# Altium project Prom21_Oculink_GPU_Ver0.1.PrjPcb
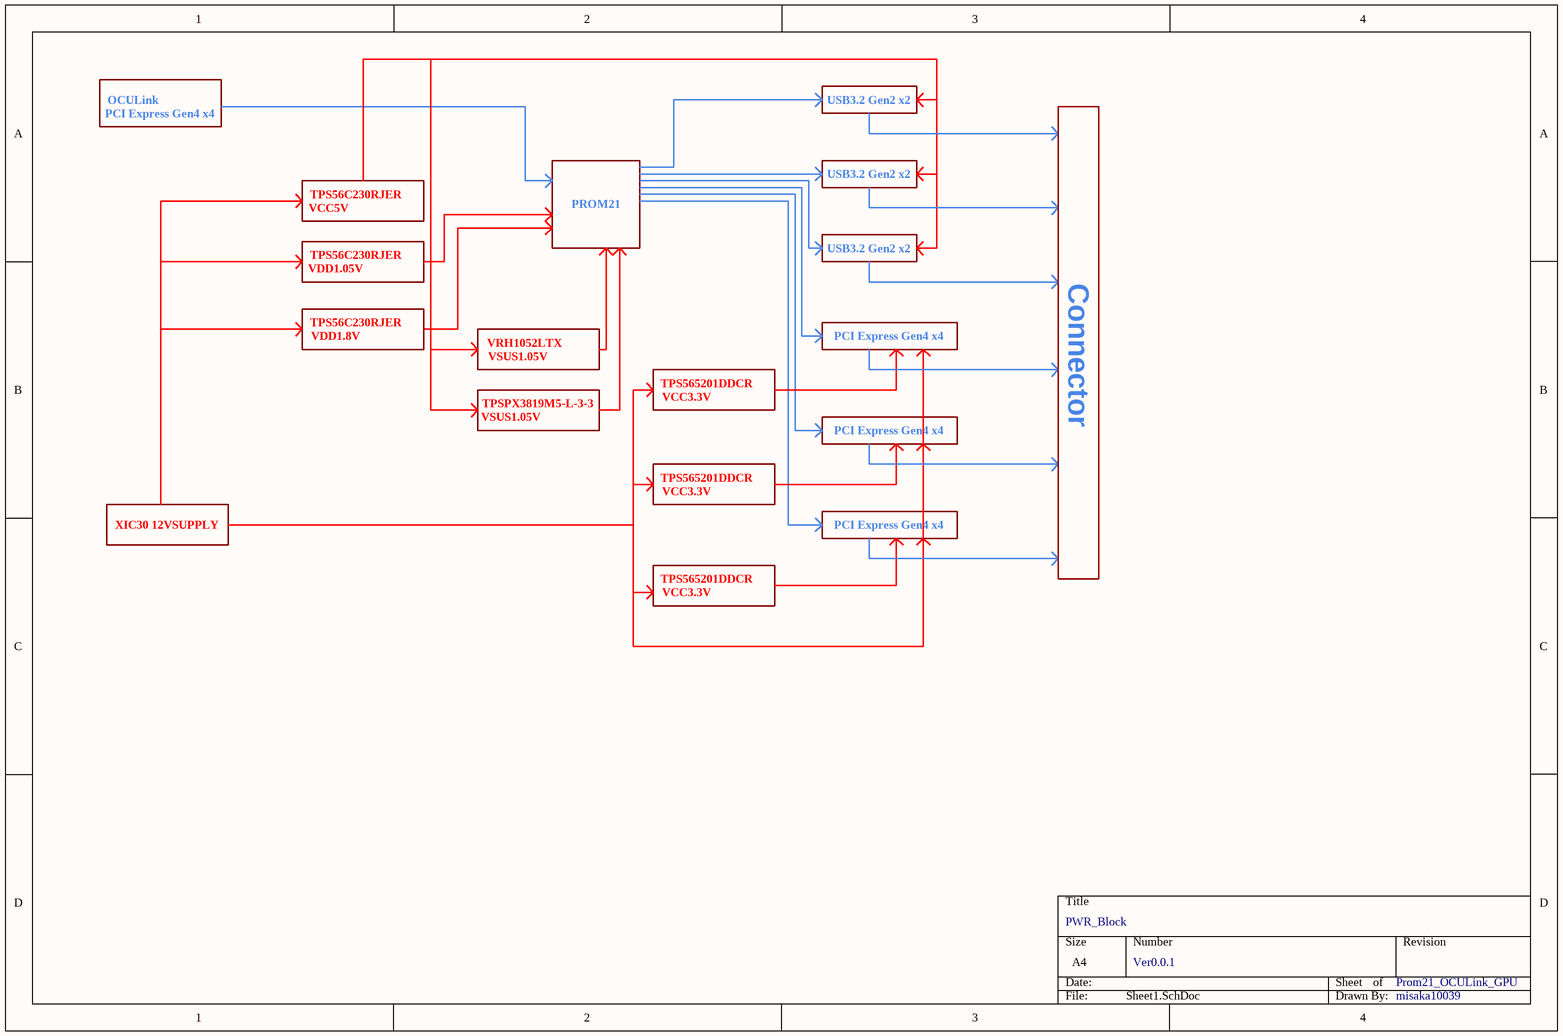
[diagram p0: Sheet1.SchDoc]
6 sheets, 307 parts. Net scope: global (net labels, ports and power ports of the same name join across sheets).
Board file: Prom21_Oculink_GPU_Ver0.1.PcbDoc
Sheets:
  Sheet1.SchDoc
  Connector.SchDoc
  Prom21Core.SchDoc
  pwr.SchDoc
  USB.SchDoc
  Signal.SchDoc

## Sheet Sheet1.SchDoc: PWR_Block
size A4; DrawnBy: misaka10039; SheetNumber: 1; SheetTotal: 4

### Notes on the sheet
- OCULink
- PCI Express Gen4 x4
- USB3.2 Gen2 x2
- VCC5V
- TPS56C230RJER
- PROM21
- VDD1.05V
- VDD1.8V
- VSUS1.05V
- VRH1052LTX
- TPS565201DDCR
- Connector
- TPSPX3819M5-L-3-3
- VCC3.3V
- XIC30 12VSUPPLY
- PWR_Block
- Ver0.0.1
- Prom21_OCULink_GPU
- misaka10039

## Sheet Connector.SchDoc
size A2; SheetNumber: 2; SheetTotal: 6
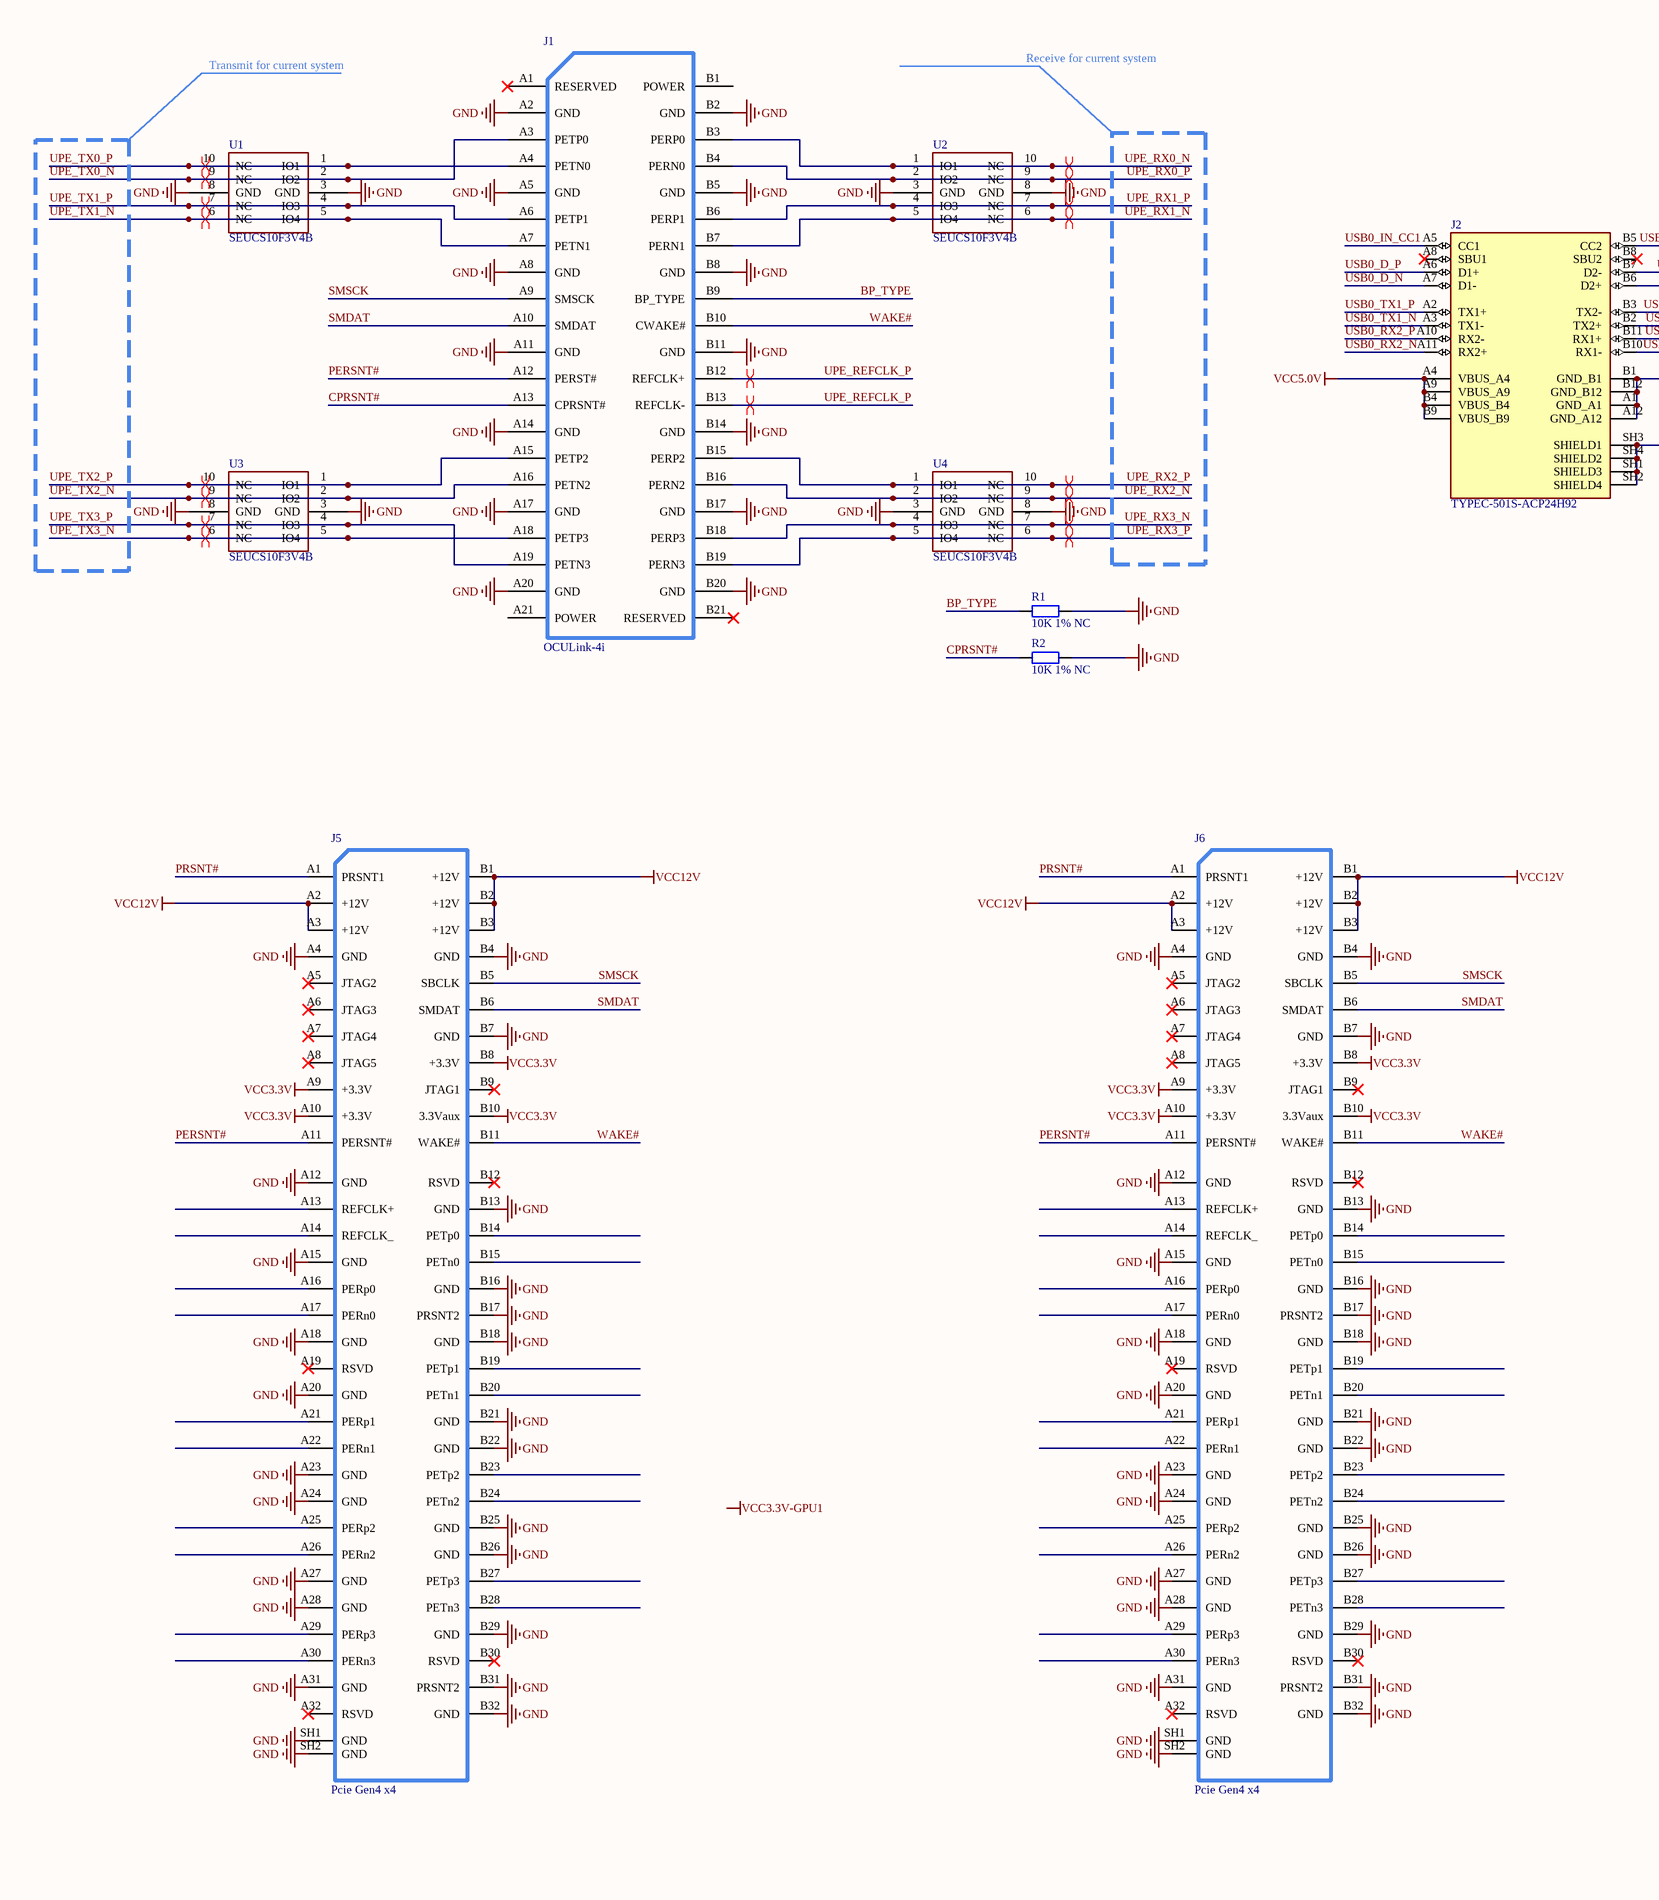
[diagram p1: Connector.SchDoc, left]
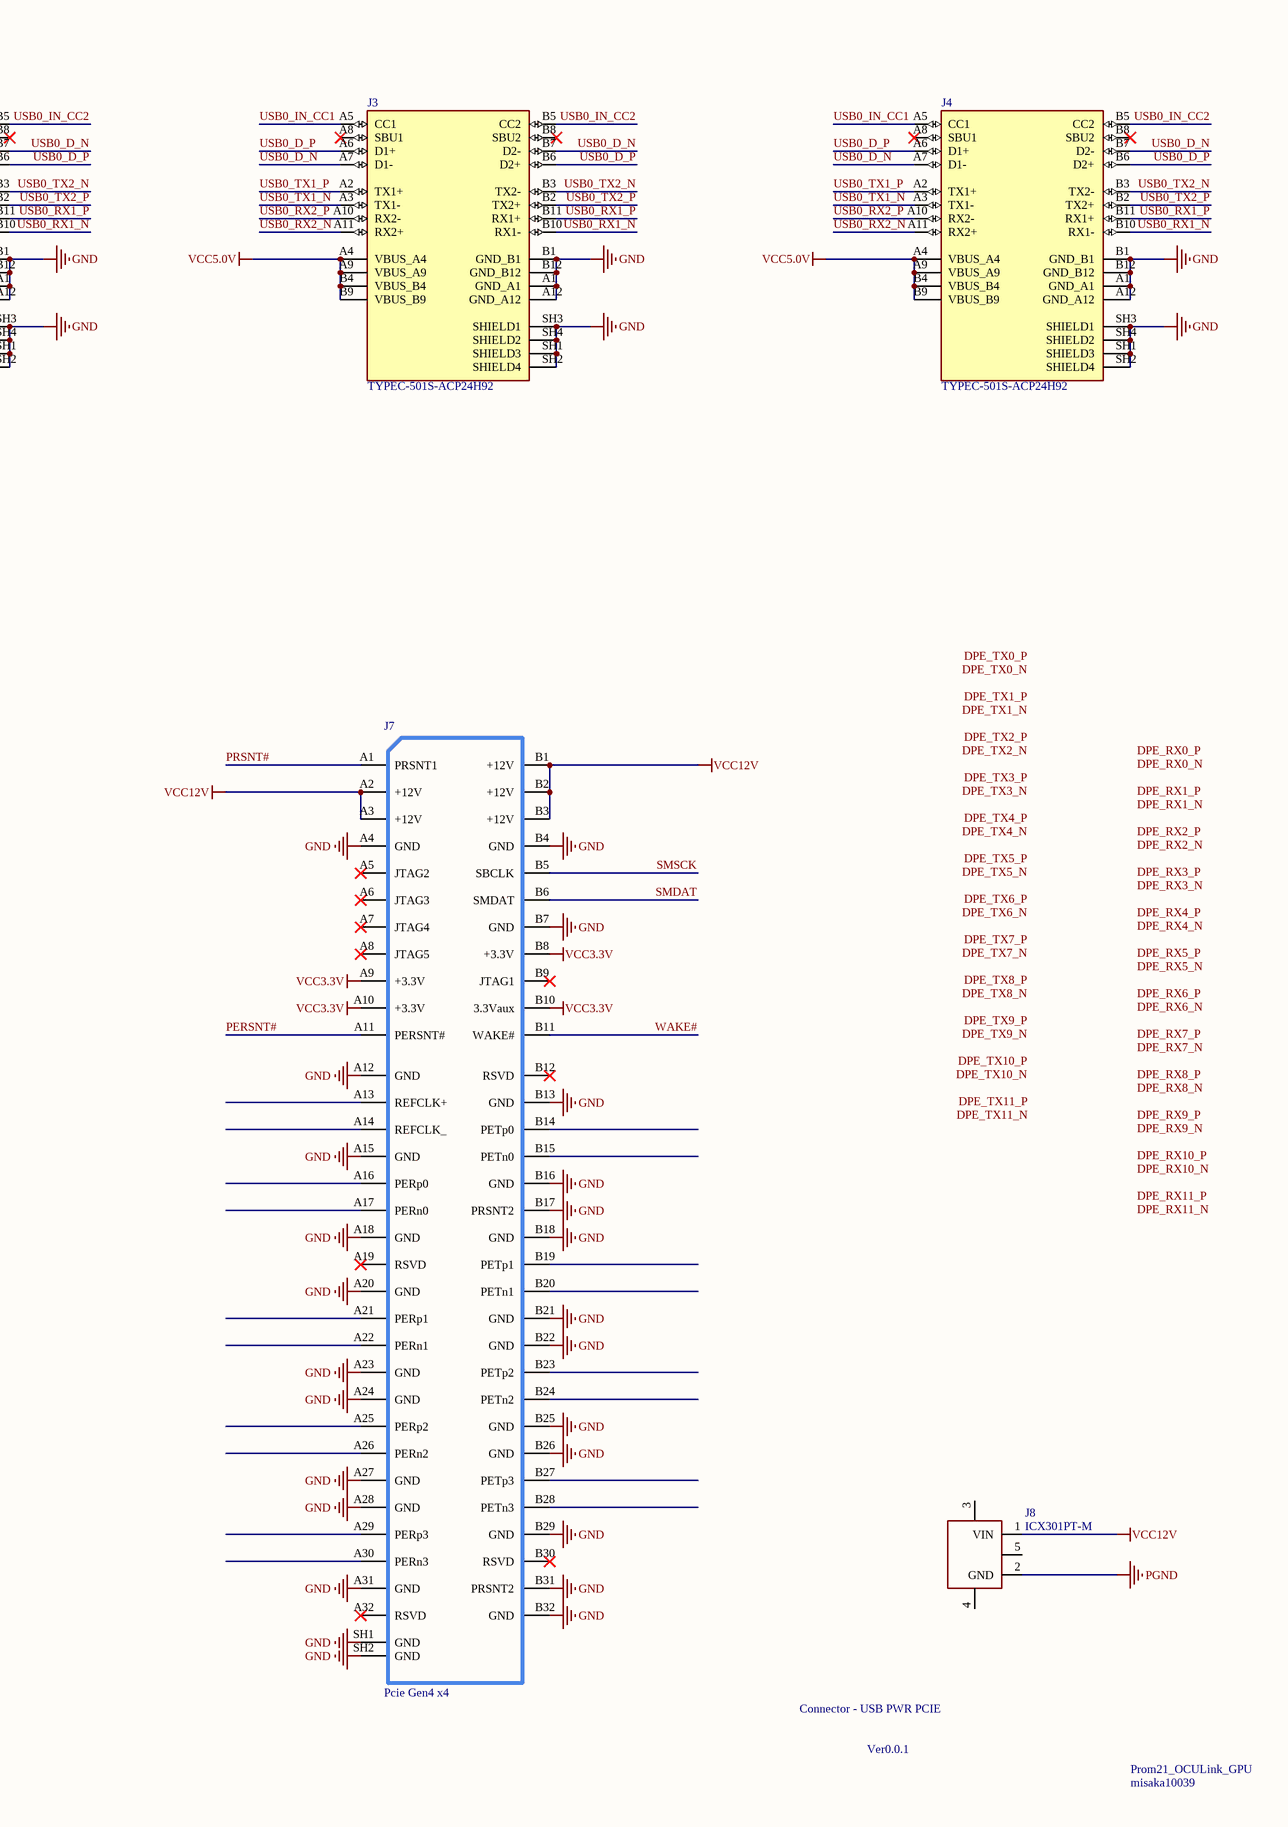
[diagram p2: Connector.SchDoc, right]

### Parts
J1  OCULink-4i  [SFF8611_卧式]
J2  TYPEC-501S-ACP24H92  [USB-C 24P Molex]
J3  TYPEC-501S-ACP24H92  [USB-C 24P Molex]
J4  TYPEC-501S-ACP24H92  [USB-C 24P Molex]
J5  Pcie Gen4 x4  [PCIe Gen4 X4 贴片]
J6  Pcie Gen4 x4  [PCIe Gen4 X4 贴片]
J7  Pcie Gen4 x4  [PCIe Gen4 X4 贴片]
J8  ICX301PT-M  [CONN-SMD_ICX301PT-M]
R1  10K 1% NC  [R0402_L]
R2  10K 1% NC  [R0402_L]
U1  SEUCS10F3V4B  [DIO_TPD4E02B04DQAR]
U2  SEUCS10F3V4B  [DIO_TPD4E02B04DQAR]
U3  SEUCS10F3V4B  [DIO_TPD4E02B04DQAR]
U4  SEUCS10F3V4B  [DIO_TPD4E02B04DQAR]

### Nets
GND: J1.A2(GND) J1.A5(GND) J1.A8(GND) J1.A11(GND) J1.A14(GND) J1.A17(GND) J1.A20(GND) J1.B2(GND) J1.B5(GND) J1.B8(GND) J1.B11(GND) J1.B14(GND) J1.B17(GND) J1.B20(GND) J2.A1(GND_A1) J2.A12(GND_A12) J2.B1(GND_B1) J2.B12(GND_B12) J2.SH1(SHIELD3) J2.SH2(SHIELD4) J2.SH3(SHIELD1) J2.SH4(SHIELD2) J3.A1(GND_A1) J3.A12(GND_A12) J3.B1(GND_B1) J3.B12(GND_B12) J3.SH1(SHIELD3) J3.SH2(SHIELD4) J3.SH3(SHIELD1) J3.SH4(SHIELD2) J4.A1(GND_A1) J4.A12(GND_A12) J4.B1(GND_B1) J4.B12(GND_B12) J4.SH1(SHIELD3) J4.SH2(SHIELD4) J4.SH3(SHIELD1) J4.SH4(SHIELD2) J5.A4(GND) J5.A12(GND) J5.A15(GND) J5.A18(GND) J5.A20(GND) J5.A23(GND) J5.A24(GND) J5.A27(GND) J5.A28(GND) J5.A31(GND) J5.B4(GND) J5.B7(GND) J5.B13(GND) J5.B16(GND) J5.B17(PRSNT2) J5.B18(GND) J5.B21(GND) J5.B22(GND) J5.B25(GND) J5.B26(GND) J5.B29(GND) J5.B31(PRSNT2) J5.B32(GND) J5.SH1(GND) J5.SH2(GND) J6.A4(GND) J6.A12(GND) J6.A15(GND) J6.A18(GND) J6.A20(GND) J6.A23(GND) J6.A24(GND) J6.A27(GND) J6.A28(GND) J6.A31(GND) J6.B4(GND) J6.B7(GND) J6.B13(GND) J6.B16(GND) J6.B17(PRSNT2) J6.B18(GND) J6.B21(GND) J6.B22(GND) J6.B25(GND) J6.B26(GND) J6.B29(GND) J6.B31(PRSNT2) J6.B32(GND) J6.SH1(GND) J6.SH2(GND) J7.A4(GND) J7.A12(GND) J7.A15(GND) J7.A18(GND) J7.A20(GND) J7.A23(GND) J7.A24(GND) J7.A27(GND) J7.A28(GND) J7.A31(GND) J7.B4(GND) J7.B7(GND) J7.B13(GND) J7.B16(GND) J7.B17(PRSNT2) J7.B18(GND) J7.B21(GND) J7.B22(GND) J7.B25(GND) J7.B26(GND) J7.B29(GND) J7.B31(PRSNT2) J7.B32(GND) J7.SH1(GND) J7.SH2(GND) R1.1 R2.1 U1.3(GND) U1.8(GND) U2.3(GND) U2.8(GND) U3.3(GND) U3.8(GND) U4.3(GND) U4.8(GND)
PGND: J8.2(GND)
VCC3.3V: J5.A9(+3.3V) J5.A10(+3.3V) J5.B8(+3.3V) J5.B10(3.3Vaux) J6.A9(+3.3V) J6.A10(+3.3V) J6.B8(+3.3V) J6.B10(3.3Vaux) J7.A9(+3.3V) J7.A10(+3.3V) J7.B8(+3.3V) J7.B10(3.3Vaux)
VCC5.0V: J2.A4(VBUS_A4) J2.A9(VBUS_A9) J2.B4(VBUS_B4) J2.B9(VBUS_B9) J3.A4(VBUS_A4) J3.A9(VBUS_A9) J3.B4(VBUS_B4) J3.B9(VBUS_B9) J4.A4(VBUS_A4) J4.A9(VBUS_A9) J4.B4(VBUS_B4) J4.B9(VBUS_B9)
VCC12V: J5.A2(+12V) J5.A3(+12V) J5.B1(+12V) J5.B2(+12V) J5.B3(+12V) J6.A2(+12V) J6.A3(+12V) J6.B1(+12V) J6.B2(+12V) J6.B3(+12V) J7.A2(+12V) J7.A3(+12V) J7.B1(+12V) J7.B2(+12V) J7.B3(+12V) J8.1(VIN)
BP_TYPE: J1.B9(BP_TYPE) R1.2
CPRSNT#: J1.A13(CPRSNT#) R2.2
PERSNT#: J1.A12(PERST#) J5.A11(PERSNT#) J6.A11(PERSNT#) J7.A11(PERSNT#)
PRSNT#: J5.A1(PRSNT1) J6.A1(PRSNT1) J7.A1(PRSNT1)
SMDAT: J1.A10(SMDAT) J5.B6(SMDAT) J6.B6(SMDAT) J7.B6(SMDAT)
SMSCK: J1.A9(SMSCK) J5.B5(SBCLK) J6.B5(SBCLK) J7.B5(SBCLK)
UPE_REFCLK_P: J1.B12(REFCLK+) J1.B13(REFCLK-)
UPE_RX0_N: J1.B3(PERP0) U2.1(IO1) U2.10(NC)
UPE_RX0_P: J1.B4(PERN0) U2.2(IO2) U2.9(NC)
UPE_RX1_N: J1.B7(PERN1) U2.5(IO4) U2.6(NC)
UPE_RX1_P: J1.B6(PERP1) U2.4(IO3) U2.7(NC)
UPE_RX2_N: J1.B16(PERN2) U4.2(IO2) U4.9(NC)
UPE_RX2_P: J1.B15(PERP2) U4.1(IO1) U4.10(NC)
UPE_RX3_N: J1.B18(PERP3) U4.4(IO3) U4.7(NC)
UPE_RX3_P: J1.B19(PERN3) U4.5(IO4) U4.6(NC)
UPE_TX0_N: J1.A3(PETP0) U1.2(IO2) U1.9(NC)
UPE_TX0_P: J1.A4(PETN0) U1.1(IO1) U1.10(NC)
UPE_TX1_N: J1.A7(PETN1) U1.5(IO4) U1.6(NC)
UPE_TX1_P: J1.A6(PETP1) U1.4(IO3) U1.7(NC)
UPE_TX2_N: J1.A16(PETN2) U3.2(IO2) U3.9(NC)
UPE_TX2_P: J1.A15(PETP2) U3.1(IO1) U3.10(NC)
UPE_TX3_N: J1.A18(PETP3) U3.5(IO4) U3.6(NC)
UPE_TX3_P: J1.A19(PETN3) U3.4(IO3) U3.7(NC)
USB0_D_N: J2.A7(D1-) J2.B7(D2-) J3.A7(D1-) J3.B7(D2-) J4.A7(D1-) J4.B7(D2-)
USB0_D_P: J2.A6(D1+) J2.B6(D2+) J3.A6(D1+) J3.B6(D2+) J4.A6(D1+) J4.B6(D2+)
USB0_IN_CC1: J2.A5(CC1) J3.A5(CC1) J4.A5(CC1)
USB0_IN_CC2: J2.B5(CC2) J3.B5(CC2) J4.B5(CC2)
USB0_RX1_N: J2.B10(RX1-) J3.B10(RX1-) J4.B10(RX1-)
USB0_RX1_P: J2.B11(RX1+) J3.B11(RX1+) J4.B11(RX1+)
USB0_RX2_N: J2.A11(RX2+) J3.A11(RX2+) J4.A11(RX2+)
USB0_RX2_P: J2.A10(RX2-) J3.A10(RX2-) J4.A10(RX2-)
USB0_TX1_N: J2.A3(TX1-) J3.A3(TX1-) J4.A3(TX1-)
USB0_TX1_P: J2.A2(TX1+) J3.A2(TX1+) J4.A2(TX1+)
USB0_TX2_N: J2.B3(TX2-) J3.B3(TX2-) J4.B3(TX2-)
USB0_TX2_P: J2.B2(TX2+) J3.B2(TX2+) J4.B2(TX2+)
WAKE#: J1.B10(CWAKE#) J5.B11(WAKE#) J6.B11(WAKE#) J7.B11(WAKE#)

Not connected (* = marked no-connect by the designer): J1 A1(RESERVED)* A21(POWER) B1(POWER) B21(RESERVED)*; J2 A8(SBU1)* B8(SBU2)*; J3 A8(SBU1)* B8(SBU2)*; J4 A8(SBU1)* B8(SBU2)*; J5 A5(JTAG2)* A6(JTAG3)* A7(JTAG4)* A8(JTAG5)* A13(REFCLK+) A14(REFCLK_) A16(PERp0) A17(PERn0) A19(RSVD)* A21(PERp1) A22(PERn1) A25(PERp2) A26(PERn2) A29(PERp3) A30(PERn3) A32(RSVD)* B9(JTAG1)* B12(RSVD)* B14(PETp0) B15(PETn0) B19(PETp1) B20(PETn1) B23(PETp2) B24(PETn2) B27(PETp3) B28(PETn3) B30(RSVD)*; J6 A5(JTAG2)* A6(JTAG3)* A7(JTAG4)* A8(JTAG5)* A13(REFCLK+) A14(REFCLK_) A16(PERp0) A17(PERn0) A19(RSVD)* A21(PERp1) A22(PERn1) A25(PERp2) A26(PERn2) A29(PERp3) A30(PERn3) A32(RSVD)* B9(JTAG1)* B12(RSVD)* B14(PETp0) B15(PETn0) B19(PETp1) B20(PETn1) B23(PETp2) B24(PETn2) B27(PETp3) B28(PETn3) B30(RSVD)*; J7 A5(JTAG2)* A6(JTAG3)* A7(JTAG4)* A8(JTAG5)* A13(REFCLK+) A14(REFCLK_) A16(PERp0) A17(PERn0) A19(RSVD)* A21(PERp1) A22(PERn1) A25(PERp2) A26(PERn2) A29(PERp3) A30(PERn3) A32(RSVD)* B9(JTAG1)* B12(RSVD)* B14(PETp0) B15(PETn0) B19(PETp1) B20(PETn1) B23(PETp2) B24(PETn2) B27(PETp3) B28(PETn3) B30(RSVD)*; J8 3 4 5

### Layout directives
differential pair: UPE_REFCLK_P, UPE_RX0_N, UPE_RX0_P, UPE_RX1_N, UPE_RX1_P, UPE_RX2_N, UPE_RX2_P, UPE_RX3_N, UPE_RX3_P, UPE_TX0_N, UPE_TX0_P, UPE_TX1_N, UPE_TX1_P, UPE_TX2_N, UPE_TX2_P, UPE_TX3_N, UPE_TX3_P

### Notes on the sheet
- Transmit for current system
- Receive for current system
- Connector - USB PWR PCIE
- Ver0.0.1
- misaka10039
- Prom21_OCULink_GPU
- Labels drawn without touching a wire or pin: DPE_RX0_N, DPE_RX0_P, DPE_RX1_N, DPE_RX1_P, DPE_RX2_N, DPE_RX2_P, DPE_RX3_N, DPE_RX3_P, DPE_RX4_N, DPE_RX4_P, DPE_RX5_N, DPE_RX5_P, DPE_RX6_N, DPE_RX6_P, DPE_RX7_N, DPE_RX7_P, DPE_RX8_N, DPE_RX8_P, DPE_RX9_N, DPE_RX9_P, DPE_RX10_N, DPE_RX10_P, DPE_RX11_N, DPE_RX11_P, DPE_TX0_N, DPE_TX0_P, DPE_TX1_N, DPE_TX1_P, DPE_TX2_N, DPE_TX2_P, DPE_TX3_N, DPE_TX3_P, DPE_TX4_N, DPE_TX4_P, DPE_TX5_N, DPE_TX5_P, DPE_TX6_N, DPE_TX6_P, DPE_TX7_N, DPE_TX7_P, DPE_TX8_N, DPE_TX8_P, DPE_TX9_N, DPE_TX9_P, DPE_TX10_N, DPE_TX10_P, DPE_TX11_N, DPE_TX11_P, VCC3.3V-GPU1

### Library data of the parts
J2-J4 = Typec 24p: USB-C (USB TYPE-C) USB 3.2 Gen 2 (USB 3.1 Gen 2, Superspeed + (USB 3.1)) Receptacle Connector 24 Position Surface Mount, Right Angle; Through Hole; MF: Molex; MP: 1054500101; SnapEDA_Link: https://www.snapeda.com/parts/1054500101/Molex/view-part/?ref=snap; Package: None; Value: *; Check_prices: https://www.snapeda.com/parts/1054500101/Molex/view-part/?ref=eda
R1 R2 = R: 贴片电阻; 版权归属: 源创客; BOM名称: 贴片电阻; 学习资源: www.ooocke.com
U1-U4 = TPD4E02B04: ESD

## Sheet Prom21Core.SchDoc
size 566 x 320 mm; SheetNumber: 3; SheetTotal: 6
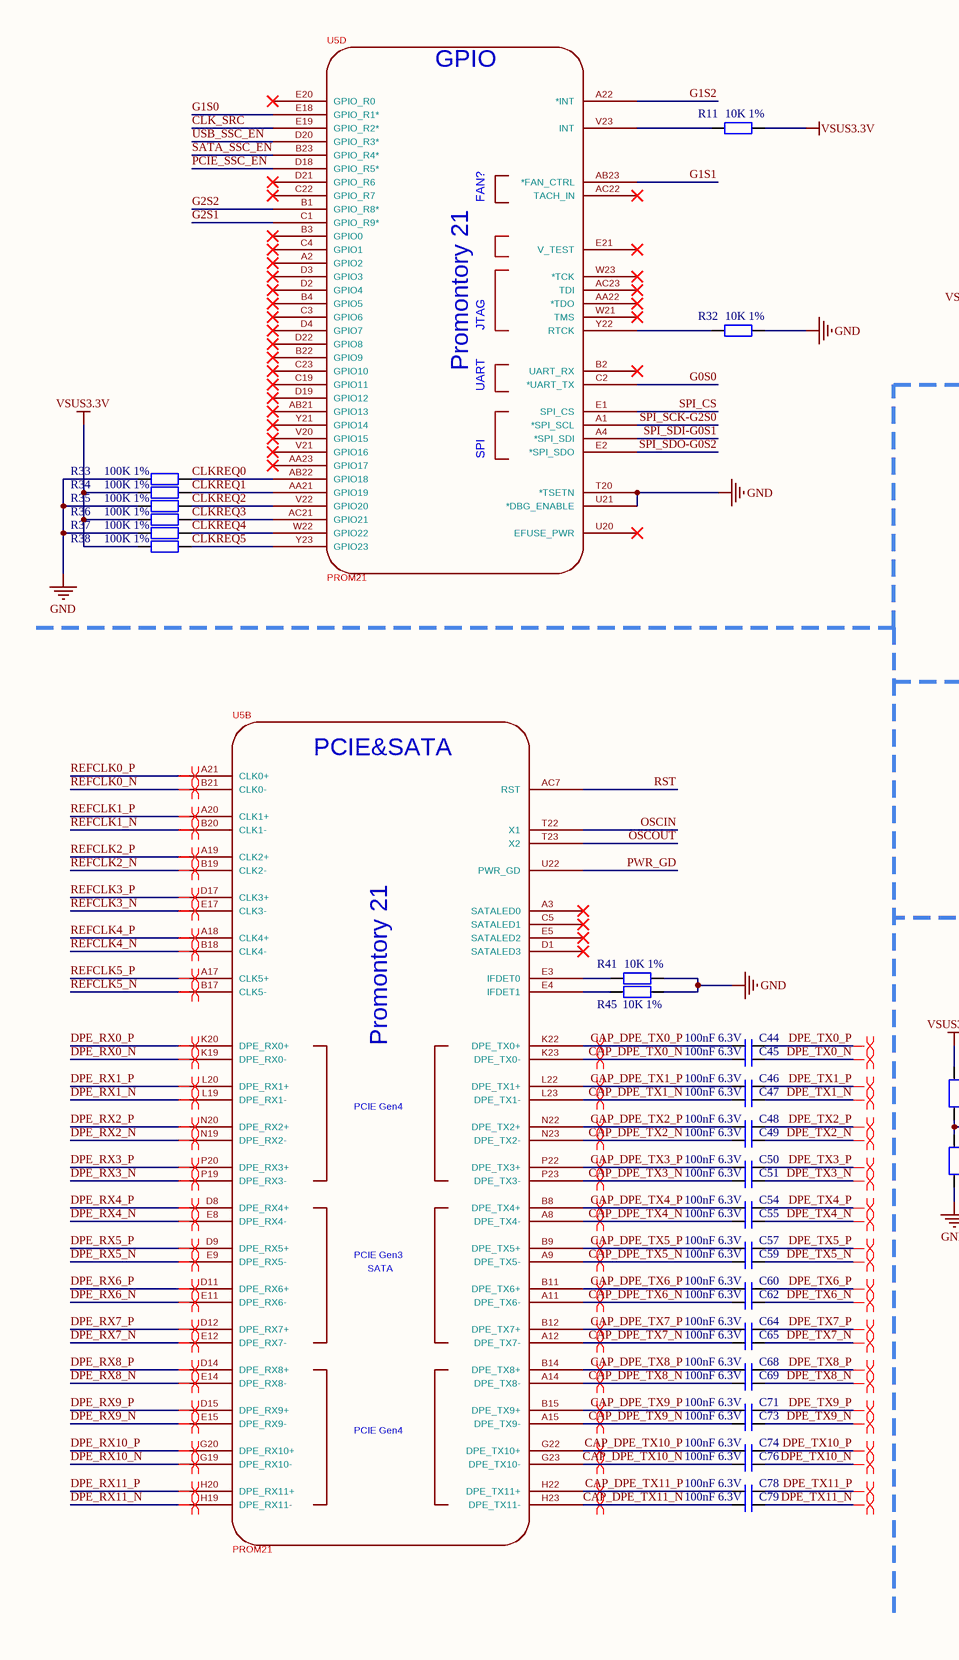
[diagram p3: Prom21Core.SchDoc, left]
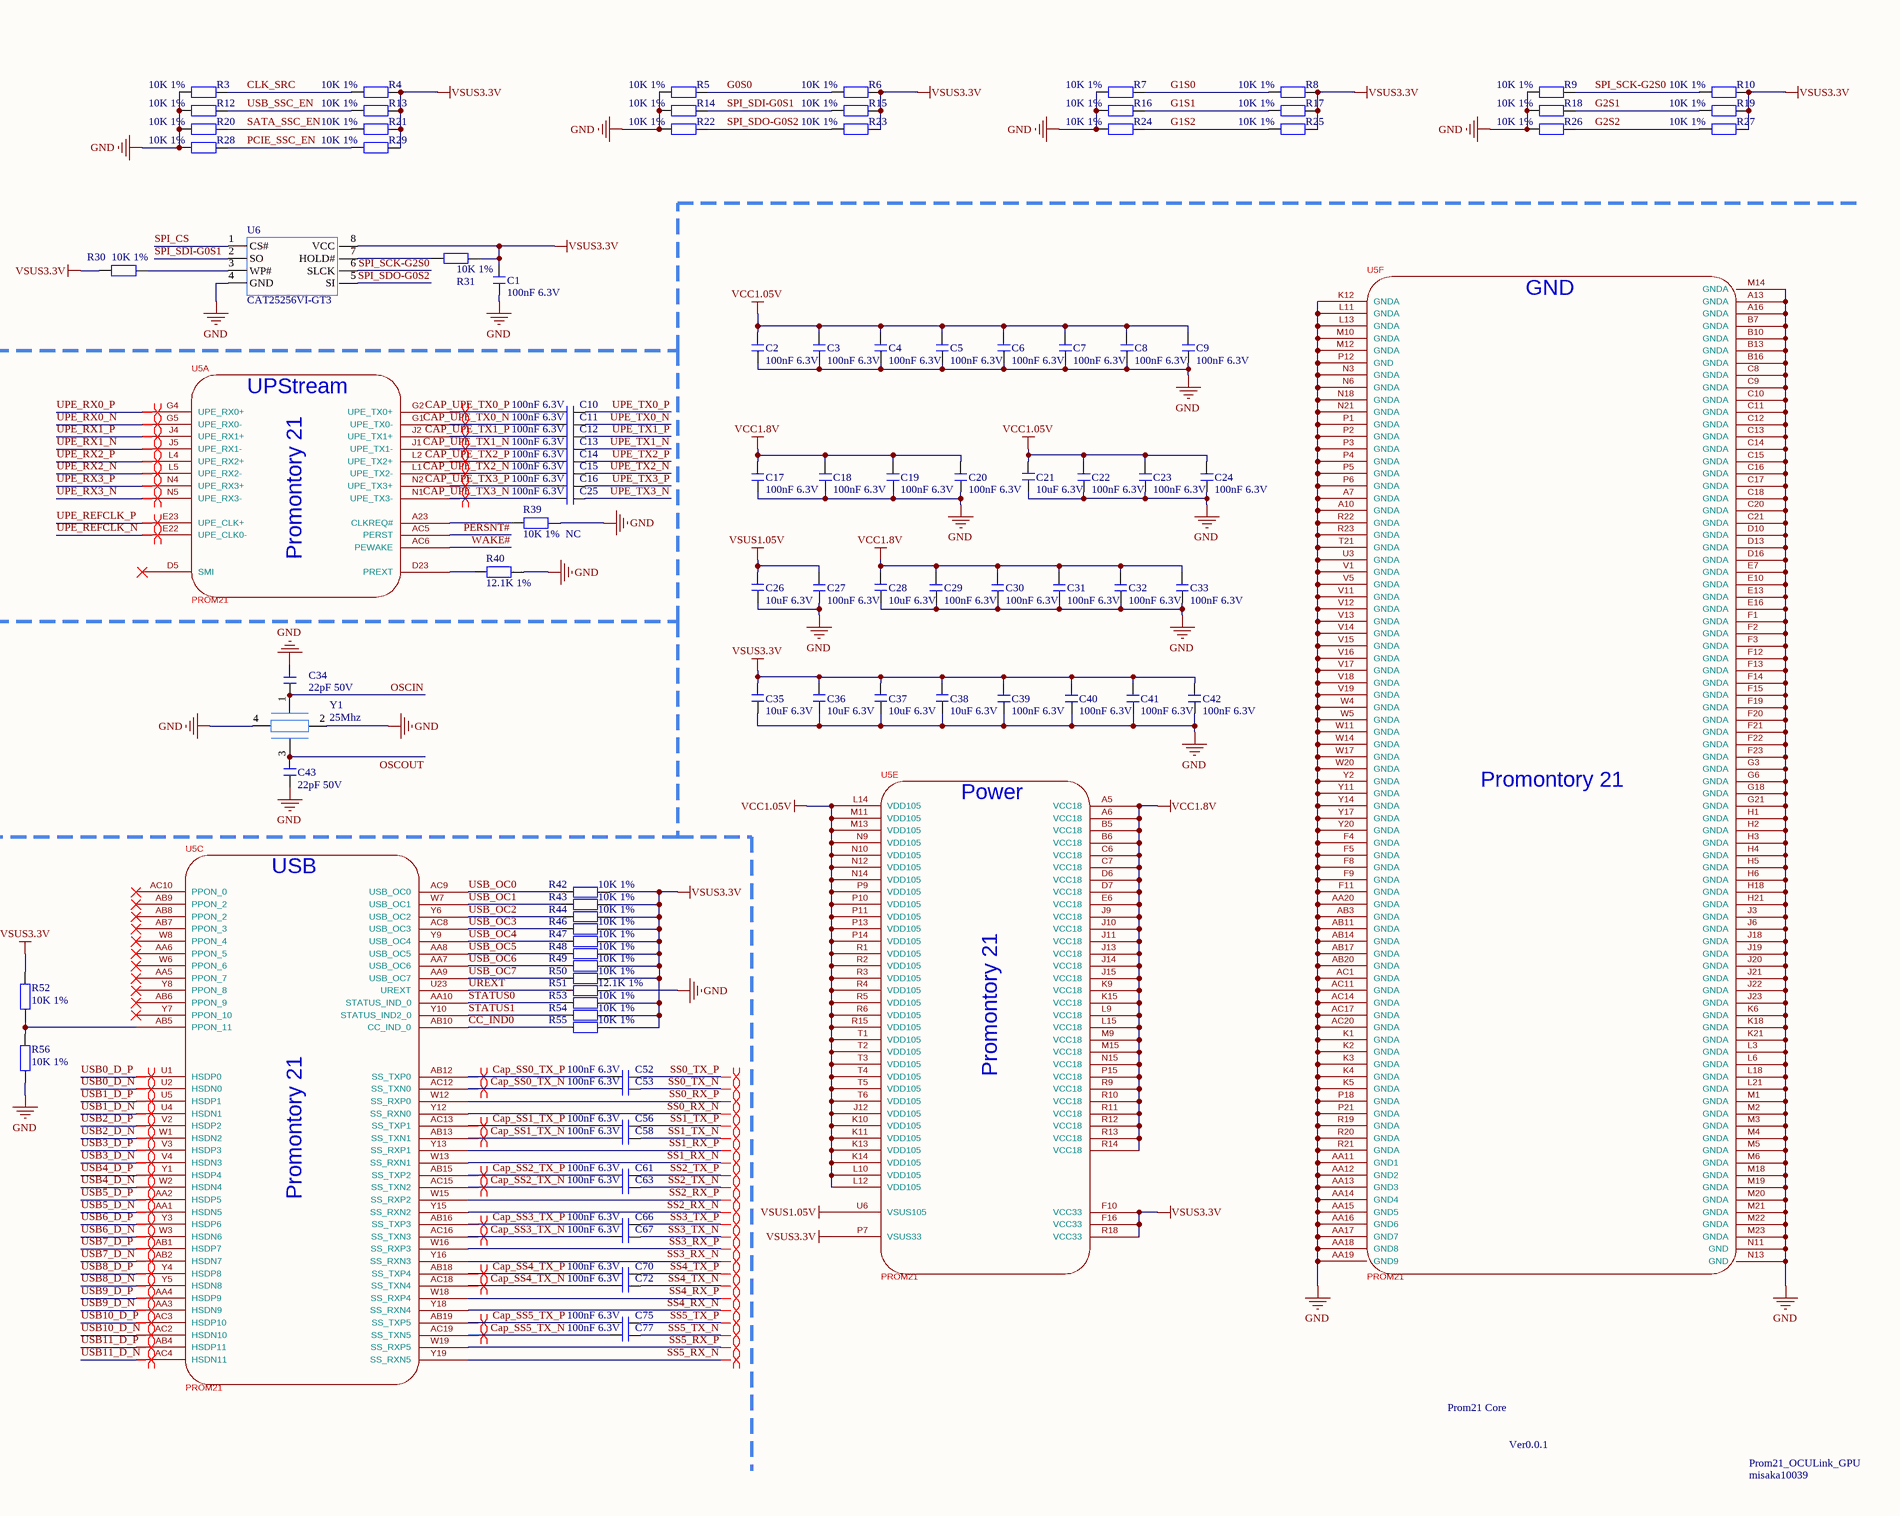
[diagram p4: Prom21Core.SchDoc, right]

### Parts
C1  100nF 6.3V  [C0402_L]
C2  100nF 6.3V  [C0402_L]
C3  100nF 6.3V  [C0402_L]
C4  100nF 6.3V  [C0402_L]
C5  100nF 6.3V  [C0402_L]
C6  100nF 6.3V  [C0402_L]
C7  100nF 6.3V  [C0402_L]
C8  100nF 6.3V  [C0402_L]
C9  100nF 6.3V  [C0402_L]
C10  100nF 6.3V  [C0402_L]
C11  100nF 6.3V  [C0402_L]
C12  100nF 6.3V  [C0402_L]
C13  100nF 6.3V  [C0402_L]
C14  100nF 6.3V  [C0402_L]
C15  100nF 6.3V  [C0402_L]
C16  100nF 6.3V  [C0402_L]
C17  100nF 6.3V  [C0402_L]
C18  100nF 6.3V  [C0402_L]
C19  100nF 6.3V  [C0402_L]
C20  100nF 6.3V  [C0402_L]
C21  10uF 6.3V  [C0603_L]
C22  100nF 6.3V  [C0402_L]
C23  100nF 6.3V  [C0402_L]
C24  100nF 6.3V  [C0402_L]
C25  100nF 6.3V  [C0402_L]
C26  10uF 6.3V  [C0603_L]
C27  100nF 6.3V  [C0402_L]
C28  10uF 6.3V  [C0603_L]
C29  100nF 6.3V  [C0402_L]
C30  100nF 6.3V  [C0402_L]
C31  100nF 6.3V  [C0402_L]
C32  100nF 6.3V  [C0402_L]
C33  100nF 6.3V  [C0402_L]
C34  22pF 50V  [C0402_L]
C35  10uF 6.3V  [C0603_L]
C36  10uF 6.3V  [C0603_L]
C37  10uF 6.3V  [C0603_L]
C38  10uF 6.3V  [C0603_L]
C39  100nF 6.3V  [C0402_L]
C40  100nF 6.3V  [C0402_L]
C41  100nF 6.3V  [C0402_L]
C42  100nF 6.3V  [C0402_L]
C43  22pF 50V  [C0402_L]
C44  100nF 6.3V  [C0402_L]
C45  100nF 6.3V  [C0402_L]
C46  100nF 6.3V  [C0402_L]
C47  100nF 6.3V  [C0402_L]
C48  100nF 6.3V  [C0402_L]
C49  100nF 6.3V  [C0402_L]
C50  100nF 6.3V  [C0402_L]
C51  100nF 6.3V  [C0402_L]
C52  100nF 6.3V  [C0402_L]
C53  100nF 6.3V  [C0402_L]
C54  100nF 6.3V  [C0402_L]
C55  100nF 6.3V  [C0402_L]
C56  100nF 6.3V  [C0402_L]
C57  100nF 6.3V  [C0402_L]
C58  100nF 6.3V  [C0402_L]
C59  100nF 6.3V  [C0402_L]
C60  100nF 6.3V  [C0402_L]
C61  100nF 6.3V  [C0402_L]
C62  100nF 6.3V  [C0402_L]
C63  100nF 6.3V  [C0402_L]
C64  100nF 6.3V  [C0402_L]
C65  100nF 6.3V  [C0402_L]
C66  100nF 6.3V  [C0402_L]
C67  100nF 6.3V  [C0402_L]
C68  100nF 6.3V  [C0402_L]
C69  100nF 6.3V  [C0402_L]
C70  100nF 6.3V  [C0402_L]
C71  100nF 6.3V  [C0402_L]
C72  100nF 6.3V  [C0402_L]
C73  100nF 6.3V  [C0402_L]
C74  100nF 6.3V  [C0402_L]
C75  100nF 6.3V  [C0402_L]
C76  100nF 6.3V  [C0402_L]
C77  100nF 6.3V  [C0402_L]
C78  100nF 6.3V  [C0402_L]
C79  100nF 6.3V  [C0402_L]
R3  10K 1%  [R0402_L]
R4  10K 1%  [R0402_L]
R5  10K 1%  [R0402_L]
R6  10K 1%  [R0402_L]
R7  10K 1%  [R0402_L]
R8  10K 1%  [R0402_L]
R9  10K 1%  [R0402_L]
R10  10K 1%  [R0402_L]
R11  10K 1%  [R0402_L]
R12  10K 1%  [R0402_L]
R13  10K 1%  [R0402_L]
R14  10K 1%  [R0402_L]
R15  10K 1%  [R0402_L]
R16  10K 1%  [R0402_L]
R17  10K 1%  [R0402_L]
R18  10K 1%  [R0402_L]
R19  10K 1%  [R0402_L]
R20  10K 1%  [R0402_L]
R21  10K 1%  [R0402_L]
R22  10K 1%  [R0402_L]
R23  10K 1%  [R0402_L]
R24  10K 1%  [R0402_L]
R25  10K 1%  [R0402_L]
R26  10K 1%  [R0402_L]
R27  10K 1%  [R0402_L]
R28  10K 1%  [R0402_L]
R29  10K 1%  [R0402_L]
R30  10K 1%  [R0402_L]
R31  10K 1%  [R0402_L]
R32  10K 1%  [R0402_L]
R33  100K 1%  [R0402_L]
R34  100K 1%  [R0402_L]
R35  100K 1%  [R0402_L]
R36  100K 1%  [R0402_L]
R37  100K 1%  [R0402_L]
R38  100K 1%  [R0402_L]
R39  10K 1%  NC  [R0402_L]
R40  12.1K 1%  [R0402_L]
R41  10K 1%  [R0402_L]
R42  10K 1%  [R0402_L]
R43  10K 1%  [R0402_L]
R44  10K 1%  [R0402_L]
R45  10K 1%  [R0402_L]
R46  10K 1%  [R0402_L]
R47  10K 1%  [R0402_L]
R48  10K 1%  [R0402_L]
R49  10K 1%  [R0402_L]
R50  10K 1%  [R0402_L]
R51  12.1K 1%  [R0402_L]
R52  10K 1%  [R0402_L]
R53  10K 1%  [R0402_L]
R54  10K 1%  [R0402_L]
R55  10K 1%  [R0402_L]
R56  10K 1%  [R0402_L]
U5  PROM21  [PROM21]  (parts A,B,C,D,E,F of 6)
U6  CAT25256VI-GT3  [SOP8_M]
Y1  25Mhz  [OSC-3225-4P]

### Nets
GND: C1.2 C2.2 C3.2 C4.2 C5.2 C6.2 C7.2 C8.2 C9.2 C17.2 C18.2 C19.2 C20.2 C21.1 C22.2 C23.2 C24.2 C26.1 C27.2 C28.1 C29.2 C30.2 C31.2 C32.2 C33.2 C34.1 C35.1 C36.1 C37.1 C38.1 C39.2 C40.2 C41.2 C42.2 C43.1 R3.1 R5.1 R7.1 R9.1 R12.1 R14.1 R16.1 R18.1 R20.1 R22.1 R24.1 R26.1 R28.1 R32.2 R33.1 R35.1 R37.1 R39.2 R40.2 R41.2 R45.2 R51.1 R56.1 U5.A7(GNDA) U5.A10(GNDA) U5.A13(GNDA) U5.A16(GNDA) U5.AA11(GND1) U5.AA12(GND2) U5.AA13(GND3) U5.AA14(GND4) U5.AA15(GND5) U5.AA16(GND6) U5.AA17(GND7) U5.AA18(GND8) U5.AA19(GND9) U5.AA20(GNDA) U5.AB3(GNDA) U5.AB11(GNDA) U5.AB14(GNDA) U5.AB17(GNDA) U5.AB20(GNDA) U5.AC1(GNDA) U5.AC11(GNDA) U5.AC14(GNDA) U5.AC17(GNDA) U5.AC20(GNDA) U5.B7(GNDA) U5.B10(GNDA) U5.B13(GNDA) U5.B16(GNDA) U5.C8(GNDA) U5.C9(GNDA) U5.C10(GNDA) U5.C11(GNDA) U5.C12(GNDA) U5.C13(GNDA) U5.C14(GNDA) U5.C15(GNDA) U5.C16(GNDA) U5.C17(GNDA) U5.C18(GNDA) U5.C20(GNDA) U5.C21(GNDA) U5.D10(GNDA) U5.D13(GNDA) U5.D16(GNDA) U5.E7(GNDA) U5.E10(GNDA) U5.E13(GNDA) U5.E16(GNDA) U5.F1(GNDA) U5.F2(GNDA) U5.F3(GNDA) U5.F4(GNDA) U5.F5(GNDA) U5.F8(GNDA) U5.F9(GNDA) U5.F11(GNDA) U5.F12(GNDA) U5.F13(GNDA) U5.F14(GNDA) U5.F15(GNDA) U5.F19(GNDA) U5.F20(GNDA) U5.F21(GNDA) U5.F22(GNDA) U5.F23(GNDA) U5.G3(GNDA) U5.G6(GNDA) U5.G18(GNDA) U5.G21(GNDA) U5.H1(GNDA) U5.H2(GNDA) U5.H3(GNDA) U5.H4(GNDA) U5.H5(GNDA) U5.H6(GNDA) U5.H18(GNDA) U5.H21(GNDA) U5.J3(GNDA) U5.J6(GNDA) U5.J18(GNDA) U5.J19(GNDA) U5.J20(GNDA) U5.J21(GNDA) U5.J22(GNDA) U5.J23(GNDA) U5.K1(GNDA) U5.K2(GNDA) U5.K3(GNDA) U5.K4(GNDA) U5.K5(GNDA) U5.K6(GNDA) U5.K12(GNDA) U5.K18(GNDA) U5.K21(GNDA) U5.L3(GNDA) U5.L6(GNDA) U5.L11(GNDA) U5.L13(GNDA) U5.L18(GNDA) U5.L21(GNDA) U5.M1(GNDA) U5.M2(GNDA) U5.M3(GNDA) U5.M4(GNDA) U5.M5(GNDA) U5.M6(GNDA) U5.M10(GNDA) U5.M12(GNDA) U5.M14(GNDA) U5.M18(GNDA) U5.M19(GNDA) U5.M20(GNDA) U5.M21(GNDA) U5.M22(GNDA) U5.M23(GNDA) U5.N3(GNDA) U5.N6(GNDA) U5.N11(GND) U5.N13(GND) U5.N18(GNDA) U5.N21(GNDA) U5.P1(GNDA) U5.P2(GNDA) U5.P3(GNDA) U5.P4(GNDA) U5.P5(GNDA) U5.P6(GNDA) U5.P12(GND) U5.P18(GNDA) U5.P21(GNDA) U5.R19(GNDA) U5.R20(GNDA) U5.R21(GNDA) U5.R22(GNDA) U5.R23(GNDA) U5.T20(*TSETN) U5.T21(GNDA) U5.U3(GNDA) U5.U21(*DBG_ENABLE) U5.V1(GNDA) U5.V5(GNDA) U5.V11(GNDA) U5.V12(GNDA) U5.V13(GNDA) U5.V14(GNDA) U5.V15(GNDA) U5.V16(GNDA) U5.V17(GNDA) U5.V18(GNDA) U5.V19(GNDA) U5.W4(GNDA) U5.W5(GNDA) U5.W11(GNDA) U5.W14(GNDA) U5.W17(GNDA) U5.W20(GNDA) U5.Y2(GNDA) U5.Y11(GNDA) U5.Y14(GNDA) U5.Y17(GNDA) U5.Y20(GNDA) U6.4(GND) Y1.2(GND) Y1.4(GND)
VCC1.05V: C2.1 C3.1 C4.1 C5.1 C6.1 C7.1 C8.1 C9.1 C21.2 C22.1 C23.1 C24.1 U5.J12(VDD105) U5.K10(VDD105) U5.K11(VDD105) U5.K13(VDD105) U5.K14(VDD105) U5.L10(VDD105) U5.L12(VDD105) U5.L14(VDD105) U5.M11(VDD105) U5.M13(VDD105) U5.N9(VDD105) U5.N10(VDD105) U5.N12(VDD105) U5.N14(VDD105) U5.P9(VDD105) U5.P10(VDD105) U5.P11(VDD105) U5.P13(VDD105) U5.P14(VDD105) U5.R1(VDD105) U5.R2(VDD105) U5.R3(VDD105) U5.R4(VDD105) U5.R5(VDD105) U5.R6(VDD105) U5.R15(VDD105) U5.T1(VDD105) U5.T2(VDD105) U5.T3(VDD105) U5.T4(VDD105) U5.T5(VDD105) U5.T6(VDD105)
VCC1.8V: C17.1 C18.1 C19.1 C20.1 C28.2 C29.1 C30.1 C31.1 C32.1 C33.1 U5.A5(VCC18) U5.A6(VCC18) U5.B5(VCC18) U5.B6(VCC18) U5.C6(VCC18) U5.C7(VCC18) U5.D6(VCC18) U5.D7(VCC18) U5.E6(VCC18) U5.J9(VCC18) U5.J10(VCC18) U5.J11(VCC18) U5.J13(VCC18) U5.J14(VCC18) U5.J15(VCC18) U5.K9(VCC18) U5.K15(VCC18) U5.L9(VCC18) U5.L15(VCC18) U5.M9(VCC18) U5.M15(VCC18) U5.N15(VCC18) U5.P15(VCC18) U5.R9(VCC18) U5.R10(VCC18) U5.R11(VCC18) U5.R12(VCC18) U5.R13(VCC18) U5.R14(VCC18)
VSUS1.05V: C26.2 C27.1 U5.U6(VSUS105)
VSUS3.3V: C1.1 C35.2 C36.2 C37.2 C38.2 C39.1 C40.1 C41.1 C42.1 R4.2 R6.2 R8.2 R10.2 R11.2 R13.2 R15.2 R17.2 R19.2 R21.2 R23.2 R25.2 R27.2 R29.2 R30.1 R31.2 R34.1 R36.1 R38.1 R42.1 R43.1 R44.1 R46.1 R47.1 R48.1 R49.1 R50.1 R52.2 R53.1 R54.1 R55.1 U5.F10(VCC33) U5.F16(VCC33) U5.P7(VSUS33) U5.R18(VCC33) U6.8(VCC)
CAP_DPE_TX0_N: C45.2 U5.K23(DPE_TX0-)
CAP_DPE_TX0_P: C44.2 U5.K22(DPE_TX0+)
CAP_DPE_TX1_N: C47.2 U5.L23(DPE_TX1-)
CAP_DPE_TX1_P: C46.2 U5.L22(DPE_TX1+)
CAP_DPE_TX2_N: C49.2 U5.N23(DPE_TX2-)
CAP_DPE_TX2_P: C48.2 U5.N22(DPE_TX2+)
CAP_DPE_TX3_N: C51.2 U5.P23(DPE_TX3-)
CAP_DPE_TX3_P: C50.2 U5.P22(DPE_TX3+)
CAP_DPE_TX4_N: C55.2 U5.A8(DPE_TX4-)
CAP_DPE_TX4_P: C54.2 U5.B8(DPE_TX4+)
CAP_DPE_TX5_N: C59.2 U5.A9(DPE_TX5-)
CAP_DPE_TX5_P: C57.2 U5.B9(DPE_TX5+)
CAP_DPE_TX6_N: C62.2 U5.A11(DPE_TX6-)
CAP_DPE_TX6_P: C60.2 U5.B11(DPE_TX6+)
CAP_DPE_TX7_N: C65.2 U5.A12(DPE_TX7-)
CAP_DPE_TX7_P: C64.2 U5.B12(DPE_TX7+)
CAP_DPE_TX8_N: C69.2 U5.A14(DPE_TX8-)
CAP_DPE_TX8_P: C68.2 U5.B14(DPE_TX8+)
CAP_DPE_TX9_N: C73.2 U5.A15(DPE_TX9-)
CAP_DPE_TX9_P: C71.2 U5.B15(DPE_TX9+)
CAP_DPE_TX10_N: C76.2 U5.G23(DPE_TX10-)
CAP_DPE_TX10_P: C74.2 U5.G22(DPE_TX10+)
CAP_DPE_TX11_N: C79.2 U5.H23(DPE_TX11-)
CAP_DPE_TX11_P: C78.2 U5.H22(DPE_TX11+)
Cap_SS0_TX_N: C53.2 U5.AC12(SS_TXN0)
Cap_SS0_TX_P: C52.2 U5.AB12(SS_TXP0)
Cap_SS1_TX_N: C58.2 U5.AB13(SS_TXN1)
Cap_SS1_TX_P: C56.2 U5.AC13(SS_TXP1)
Cap_SS2_TX_N: C63.2 U5.AC15(SS_TXN2)
Cap_SS2_TX_P: C61.2 U5.AB15(SS_TXP2)
Cap_SS3_TX_N: C67.2 U5.AC16(SS_TXN3)
Cap_SS3_TX_P: C66.2 U5.AB16(SS_TXP3)
Cap_SS4_TX_N: C72.2 U5.AC18(SS_TXN4)
Cap_SS4_TX_P: C70.2 U5.AB18(SS_TXP4)
Cap_SS5_TX_N: C77.2 U5.AC19(SS_TXN5)
Cap_SS5_TX_P: C75.2 U5.AB19(SS_TXP5)
CAP_UPE_TX0_N: C11.2 U5.G1(UPE_TX0-)
CAP_UPE_TX0_P: C10.2 U5.G2(UPE_TX0+)
CAP_UPE_TX1_N: C13.2 U5.J1(UPE_TX1-)
CAP_UPE_TX1_P: C12.2 U5.J2(UPE_TX1+)
CAP_UPE_TX2_N: C15.2 U5.L1(UPE_TX2-)
CAP_UPE_TX2_P: C14.2 U5.L2(UPE_TX2+)
CAP_UPE_TX3_N: C25.2 U5.N1(UPE_TX3-)
CAP_UPE_TX3_P: C16.2 U5.N2(UPE_TX3+)
CC_IND0: R55.2 U5.AB10(CC_IND_0)
CLK_SRC: R3.2 R4.1 U5.E19(GPIO_R2*)
CLKREQ0: R33.2 U5.AB22(GPIO18)
CLKREQ1: R34.2 U5.AA21(GPIO19)
CLKREQ2: R35.2 U5.V22(GPIO20)
CLKREQ3: R36.2 U5.AC21(GPIO21)
CLKREQ4: R37.2 U5.W22(GPIO22)
CLKREQ5: R38.2 U5.Y23(GPIO23)
DPE_RX0_N: U5.K19(DPE_RX0-)
DPE_RX0_P: U5.K20(DPE_RX0+)
DPE_RX1_N: U5.L19(DPE_RX1-)
DPE_RX1_P: U5.L20(DPE_RX1+)
DPE_RX2_N: U5.N19(DPE_RX2-)
DPE_RX2_P: U5.N20(DPE_RX2+)
DPE_RX3_N: U5.P19(DPE_RX3-)
DPE_RX3_P: U5.P20(DPE_RX3+)
DPE_RX4_N: U5.E8(DPE_RX4-)
DPE_RX4_P: U5.D8(DPE_RX4+)
DPE_RX5_N: U5.E9(DPE_RX5-)
DPE_RX5_P: U5.D9(DPE_RX5+)
DPE_RX6_N: U5.E11(DPE_RX6-)
DPE_RX6_P: U5.D11(DPE_RX6+)
DPE_RX7_N: U5.E12(DPE_RX7-)
DPE_RX7_P: U5.D12(DPE_RX7+)
DPE_RX8_N: U5.E14(DPE_RX8-)
DPE_RX8_P: U5.D14(DPE_RX8+)
DPE_RX9_N: U5.E15(DPE_RX9-)
DPE_RX9_P: U5.D15(DPE_RX9+)
DPE_RX10_N: U5.G19(DPE_RX10-)
DPE_RX10_P: U5.G20(DPE_RX10+)
DPE_RX11_N: U5.H19(DPE_RX11-)
DPE_RX11_P: U5.H20(DPE_RX11+)
DPE_TX0_N: C45.1
DPE_TX0_P: C44.1
DPE_TX1_N: C47.1
DPE_TX1_P: C46.1
DPE_TX2_N: C49.1
DPE_TX2_P: C48.1
DPE_TX3_N: C51.1
DPE_TX3_P: C50.1
DPE_TX4_N: C55.1
DPE_TX4_P: C54.1
DPE_TX5_N: C59.1
DPE_TX5_P: C57.1
DPE_TX6_N: C62.1
DPE_TX6_P: C60.1
DPE_TX7_N: C65.1
DPE_TX7_P: C64.1
DPE_TX8_N: C69.1
DPE_TX8_P: C68.1
DPE_TX9_N: C73.1
DPE_TX9_P: C71.1
DPE_TX10_N: C76.1
DPE_TX10_P: C74.1
DPE_TX11_N: C79.1
DPE_TX11_P: C78.1
G0S0: R5.2 R6.1 U5.C2(*UART_TX)
G1S0: R7.2 R8.1 U5.E18(GPIO_R1*)
G1S1: R16.2 R17.1 U5.AB23(*FAN_CTRL)
G1S2: R24.2 R25.1 U5.A22(*INT)
G2S1: R18.2 R19.1 U5.C1(GPIO_R9*)
G2S2: R26.2 R27.1 U5.B1(GPIO_R8*)
OSCIN: C34.2 U5.T22(X1) Y1.1(XTAL_N)
OSCOUT: C43.2 U5.T23(X2) Y1.3(XTAL_P)
PCIE_SSC_EN: R28.2 R29.1 U5.D18(GPIO_R5*)
PERSNT#: U5.AC5(PERST)
PWR_GD: U5.U22(PWR_GD)
REFCLK0_N: U5.B21(CLK0-)
REFCLK0_P: U5.A21(CLK0+)
REFCLK1_N: U5.B20(CLK1-)
REFCLK1_P: U5.A20(CLK1+)
REFCLK2_N: U5.B19(CLK2-)
REFCLK2_P: U5.A19(CLK2+)
REFCLK3_N: U5.E17(CLK3-)
REFCLK3_P: U5.D17(CLK3+)
REFCLK4_N: U5.B18(CLK4-)
REFCLK4_P: U5.A18(CLK4+)
REFCLK5_N: U5.B17(CLK5-)
REFCLK5_P: U5.A17(CLK5+)
RST: U5.AC7(RST)
SATA_SSC_EN: R20.2 R21.1 U5.B23(GPIO_R4*)
SPI_CS: U5.E1(SPI_CS) U6.1(CS#)
SPI_SCK-G2S0: R9.2 R10.1 U5.A1(*SPI_SCL) U6.6(SLCK)
SPI_SDI-G0S1: R14.2 R15.1 U5.A4(*SPI_SDI) U6.2(SO)
SPI_SDO-G0S2: R22.2 R23.1 U5.E2(*SPI_SDO) U6.5(SI)
SS0_RX_N: U5.Y12(SS_RXN0)
SS0_RX_P: U5.W12(SS_RXP0)
SS0_TX_N: C53.1
SS0_TX_P: C52.1
SS1_RX_N: U5.W13(SS_RXN1)
SS1_RX_P: U5.Y13(SS_RXP1)
SS1_TX_N: C58.1
SS1_TX_P: C56.1
SS2_RX_N: U5.Y15(SS_RXN2)
SS2_RX_P: U5.W15(SS_RXP2)
SS2_TX_N: C63.1
SS2_TX_P: C61.1
SS3_RX_N: U5.Y16(SS_RXN3)
SS3_RX_P: U5.W16(SS_RXP3)
SS3_TX_N: C67.1
SS3_TX_P: C66.1
SS4_RX_N: U5.Y18(SS_RXN4)
SS4_RX_P: U5.W18(SS_RXP4)
SS4_TX_N: C72.1
SS4_TX_P: C70.1
SS5_RX_N: U5.Y19(SS_RXN5)
SS5_RX_P: U5.W19(SS_RXP5)
SS5_TX_N: C77.1
SS5_TX_P: C75.1
STATUS0: R53.2 U5.AA10(STATUS_IND_0)
STATUS1: R54.2 U5.Y10(STATUS_IND2_0)
UPE_REFCLK_N: U5.E22(UPE_CLK0-)
UPE_REFCLK_P: U5.E23(UPE_CLK+)
UPE_RX0_N: U5.G5(UPE_RX0-)
UPE_RX0_P: U5.G4(UPE_RX0+)
UPE_RX1_N: U5.J5(UPE_RX1-)
UPE_RX1_P: U5.J4(UPE_RX1+)
UPE_RX2_N: U5.L5(UPE_RX2-)
UPE_RX2_P: U5.L4(UPE_RX2+)
UPE_RX3_N: U5.N5(UPE_RX3-)
UPE_RX3_P: U5.N4(UPE_RX3+)
UPE_TX0_N: C11.1
UPE_TX0_P: C10.1
UPE_TX1_N: C13.1
UPE_TX1_P: C12.1
UPE_TX2_N: C15.1
UPE_TX2_P: C14.1
UPE_TX3_N: C25.1
UPE_TX3_P: C16.1
UREXT: R51.2 U5.U23(UREXT)
USB0_D_N: U5.U2(HSDN0)
USB0_D_P: U5.U1(HSDP0)
USB1_D_N: U5.U4(HSDN1)
USB1_D_P: U5.U5(HSDP1)
USB2_D_N: U5.W1(HSDN2)
USB2_D_P: U5.V2(HSDP2)
USB3_D_N: U5.V4(HSDN3)
USB3_D_P: U5.V3(HSDP3)
USB4_D_N: U5.W2(HSDN4)
USB4_D_P: U5.Y1(HSDP4)
USB5_D_N: U5.AA1(HSDN5)
USB5_D_P: U5.AA2(HSDP5)
USB6_D_N: U5.W3(HSDN6)
USB6_D_P: U5.Y3(HSDP6)
USB7_D_N: U5.AB2(HSDN7)
USB7_D_P: U5.AB1(HSDP7)
USB8_D_N: U5.Y5(HSDN8)
USB8_D_P: U5.Y4(HSDP8)
USB9_D_N: U5.AA3(HSDN9)
USB9_D_P: U5.AA4(HSDP9)
USB10_D_N: U5.AC2(HSDN10)
USB10_D_P: U5.AC3(HSDP10)
USB11_D_N: U5.AC4(HSDN11)
USB11_D_P: U5.AB4(HSDP11)
USB_OC0: R42.2 U5.AC9(USB_OC0)
USB_OC1: R43.2 U5.W7(USB_OC1)
USB_OC2: R44.2 U5.Y6(USB_OC2)
USB_OC3: R46.2 U5.AC8(USB_OC3)
USB_OC4: R47.2 U5.Y9(USB_OC4)
USB_OC5: R48.2 U5.AA8(USB_OC5)
USB_OC6: R49.2 U5.AA7(USB_OC6)
USB_OC7: R50.2 U5.AA9(USB_OC7)
USB_SSC_EN: R12.2 R13.1 U5.D20(GPIO_R3*)
WAKE#: U5.AC6(PEWAKE)
NetR11_1: R11.1 U5.V23(INT)
NetR30_2: R30.2 U6.3(WP#)
NetR31_1: R31.1 U6.7(HOLD#)
NetR32_1: R32.1 U5.Y22(RTCK)
NetR39_1: R39.1 U5.A23(CLKREQ#)
NetR40_1: R40.1 U5.D23(PREXT)
NetR41_1: R41.1 U5.E3(IFDET0)
NetR45_1: R45.1 U5.E4(IFDET1)
NetR52_1: R52.1 R56.2 U5.AB5(PPON_11)

Not connected (* = marked no-connect by the designer): U5 A2(GPIO2)* A3(SATALED0)* AA5(PPON_7)* AA6(PPON_5)* AA22(*TDO)* AA23(GPIO17)* AB6(PPON_9)* AB7(PPON_3)* AB8(PPON_2)* AB9(PPON_2)* AB21(GPIO13)* AC10(PPON_0)* AC22(TACH_IN)* AC23(TDI)* B2(UART_RX)* B3(GPIO0)* B4(GPIO5)* B22(GPIO9)* C3(GPIO6)* C4(GPIO1)* C5(SATALED1)* C19(GPIO11)* C22(GPIO_R7)* C23(GPIO10)* D1(SATALED3)* D2(GPIO4)* D3(GPIO3)* D4(GPIO7)* D5(SMI)* D19(GPIO12)* D21(GPIO_R6)* D22(GPIO8)* E5(SATALED2)* E20(GPIO_R0)* E21(V_TEST)* U20(EFUSE_PWR)* V20(GPIO15)* V21(GPIO16)* W6(PPON_6)* W8(PPON_4)* W21(TMS)* W23(*TCK)* Y7(PPON_10)* Y8(PPON_8)* Y21(GPIO14)*

### Layout directives
differential pair: CAP_DPE_TX0_N, CAP_DPE_TX0_P, CAP_DPE_TX1_N, CAP_DPE_TX1_P, CAP_DPE_TX2_N, CAP_DPE_TX2_P, CAP_DPE_TX3_N, CAP_DPE_TX3_P, CAP_DPE_TX4_N, CAP_DPE_TX4_P, CAP_DPE_TX5_N, CAP_DPE_TX5_P, CAP_DPE_TX6_N, CAP_DPE_TX6_P, CAP_DPE_TX7_N, CAP_DPE_TX7_P, CAP_DPE_TX8_N, CAP_DPE_TX8_P, CAP_DPE_TX9_N, CAP_DPE_TX9_P, CAP_DPE_TX10_N, CAP_DPE_TX10_P, CAP_DPE_TX11_N, CAP_DPE_TX11_P, Cap_SS0_TX_N, Cap_SS0_TX_P, Cap_SS1_TX_N, Cap_SS1_TX_P, Cap_SS2_TX_N, Cap_SS2_TX_P, Cap_SS3_TX_N, Cap_SS3_TX_P, Cap_SS4_TX_N, Cap_SS4_TX_P, Cap_SS5_TX_N, Cap_SS5_TX_P, CAP_UPE_TX0_N, CAP_UPE_TX0_P, CAP_UPE_TX1_N, CAP_UPE_TX1_P, CAP_UPE_TX2_N, CAP_UPE_TX2_P, CAP_UPE_TX3_N, CAP_UPE_TX3_P, DPE_RX0_N, DPE_RX0_P, DPE_RX1_N, DPE_RX1_P, DPE_RX2_N, DPE_RX2_P, DPE_RX3_N, DPE_RX3_P, DPE_RX4_N, DPE_RX4_P, DPE_RX5_N, DPE_RX5_P, DPE_RX6_N, DPE_RX6_P, DPE_RX7_N, DPE_RX7_P, DPE_RX8_N, DPE_RX8_P, DPE_RX9_N, DPE_RX9_P, DPE_RX10_N, DPE_RX10_P, DPE_RX11_N, DPE_RX11_P, DPE_TX0_N, DPE_TX0_P, DPE_TX1_N, DPE_TX1_P, DPE_TX2_N, DPE_TX2_P, DPE_TX3_N, DPE_TX3_P, DPE_TX4_N, DPE_TX4_P, DPE_TX5_N, DPE_TX5_P, DPE_TX6_N, DPE_TX6_P, DPE_TX7_N, DPE_TX7_P, DPE_TX8_N, DPE_TX8_P, DPE_TX9_N, DPE_TX9_P, DPE_TX10_N, DPE_TX10_P, DPE_TX11_N, DPE_TX11_P, REFCLK0_N, REFCLK0_P, REFCLK1_N, REFCLK1_P, REFCLK2_N, REFCLK2_P, REFCLK3_N, REFCLK3_P, REFCLK4_N, REFCLK4_P, REFCLK5_N, REFCLK5_P, SS0_RX_N, SS0_RX_P, SS0_TX_N, SS0_TX_P, SS1_RX_N, SS1_RX_P, SS1_TX_N, SS1_TX_P, SS2_RX_N, SS2_RX_P, SS2_TX_N, SS2_TX_P, SS3_RX_N, SS3_RX_P, SS3_TX_N, SS3_TX_P, SS4_RX_N, SS4_RX_P, SS4_TX_N, SS4_TX_P, SS5_RX_N, SS5_RX_P, SS5_TX_N, SS5_TX_P, UPE_REFCLK_N, UPE_REFCLK_P, UPE_RX0_N, UPE_RX0_P, UPE_RX1_N, UPE_RX1_P, UPE_RX2_N, UPE_RX2_P, UPE_RX3_N, UPE_RX3_P, USB0_D_N, USB0_D_P, USB1_D_N, USB1_D_P, USB2_D_N, USB2_D_P, USB3_D_N, USB3_D_P, USB4_D_N, USB4_D_P, USB5_D_N, USB5_D_P, USB6_D_N, USB6_D_P, USB7_D_N, USB7_D_P, USB8_D_N, USB8_D_P, USB9_D_N, USB9_D_P, USB10_D_N, USB10_D_P, USB11_D_N, USB11_D_P

### Notes on the sheet
- Prom21 Core
- Ver0.0.1
- Prom21_OCULink_GPU
- misaka10039
- (in symbol PROM21, part A) UPStream; Promontory 21
- (in symbol PROM21, part B) PCIE&SATA; Promontory 21; PCIE Gen4; PCIE Gen3; SATA
- (in symbol PROM21, part C) USB; Promontory 21
- (in symbol PROM21, part D) GPIO; FAN?; JTAG; Promontory 21; UART; SPI
- (in symbol PROM21, part E) Power; Promontory 21
- (in symbol PROM21, part F) Promontory 21

### Library data of the parts
C1-C79 = C: 无极性贴片电容; 版权归属: 源创客; 材质: X7R; BOM名称: 无极性贴片电容; 学习资源: www.ooocke.com
R3-R56 = R: 贴片电阻; 版权归属: 源创客; BOM名称: 贴片电阻; 学习资源: www.ooocke.com
U5 = PROM21: AMD B650; Relevance: []; AddInBom: yes; Device: PROM21; ConvertToPcb: yes; SymbolName: PROM21; FootprintName: PROM21
U6 = P25D40H
Y1 = Crystal

## Sheet pwr.SchDoc
size A3; SheetNumber: 4; SheetTotal: 6
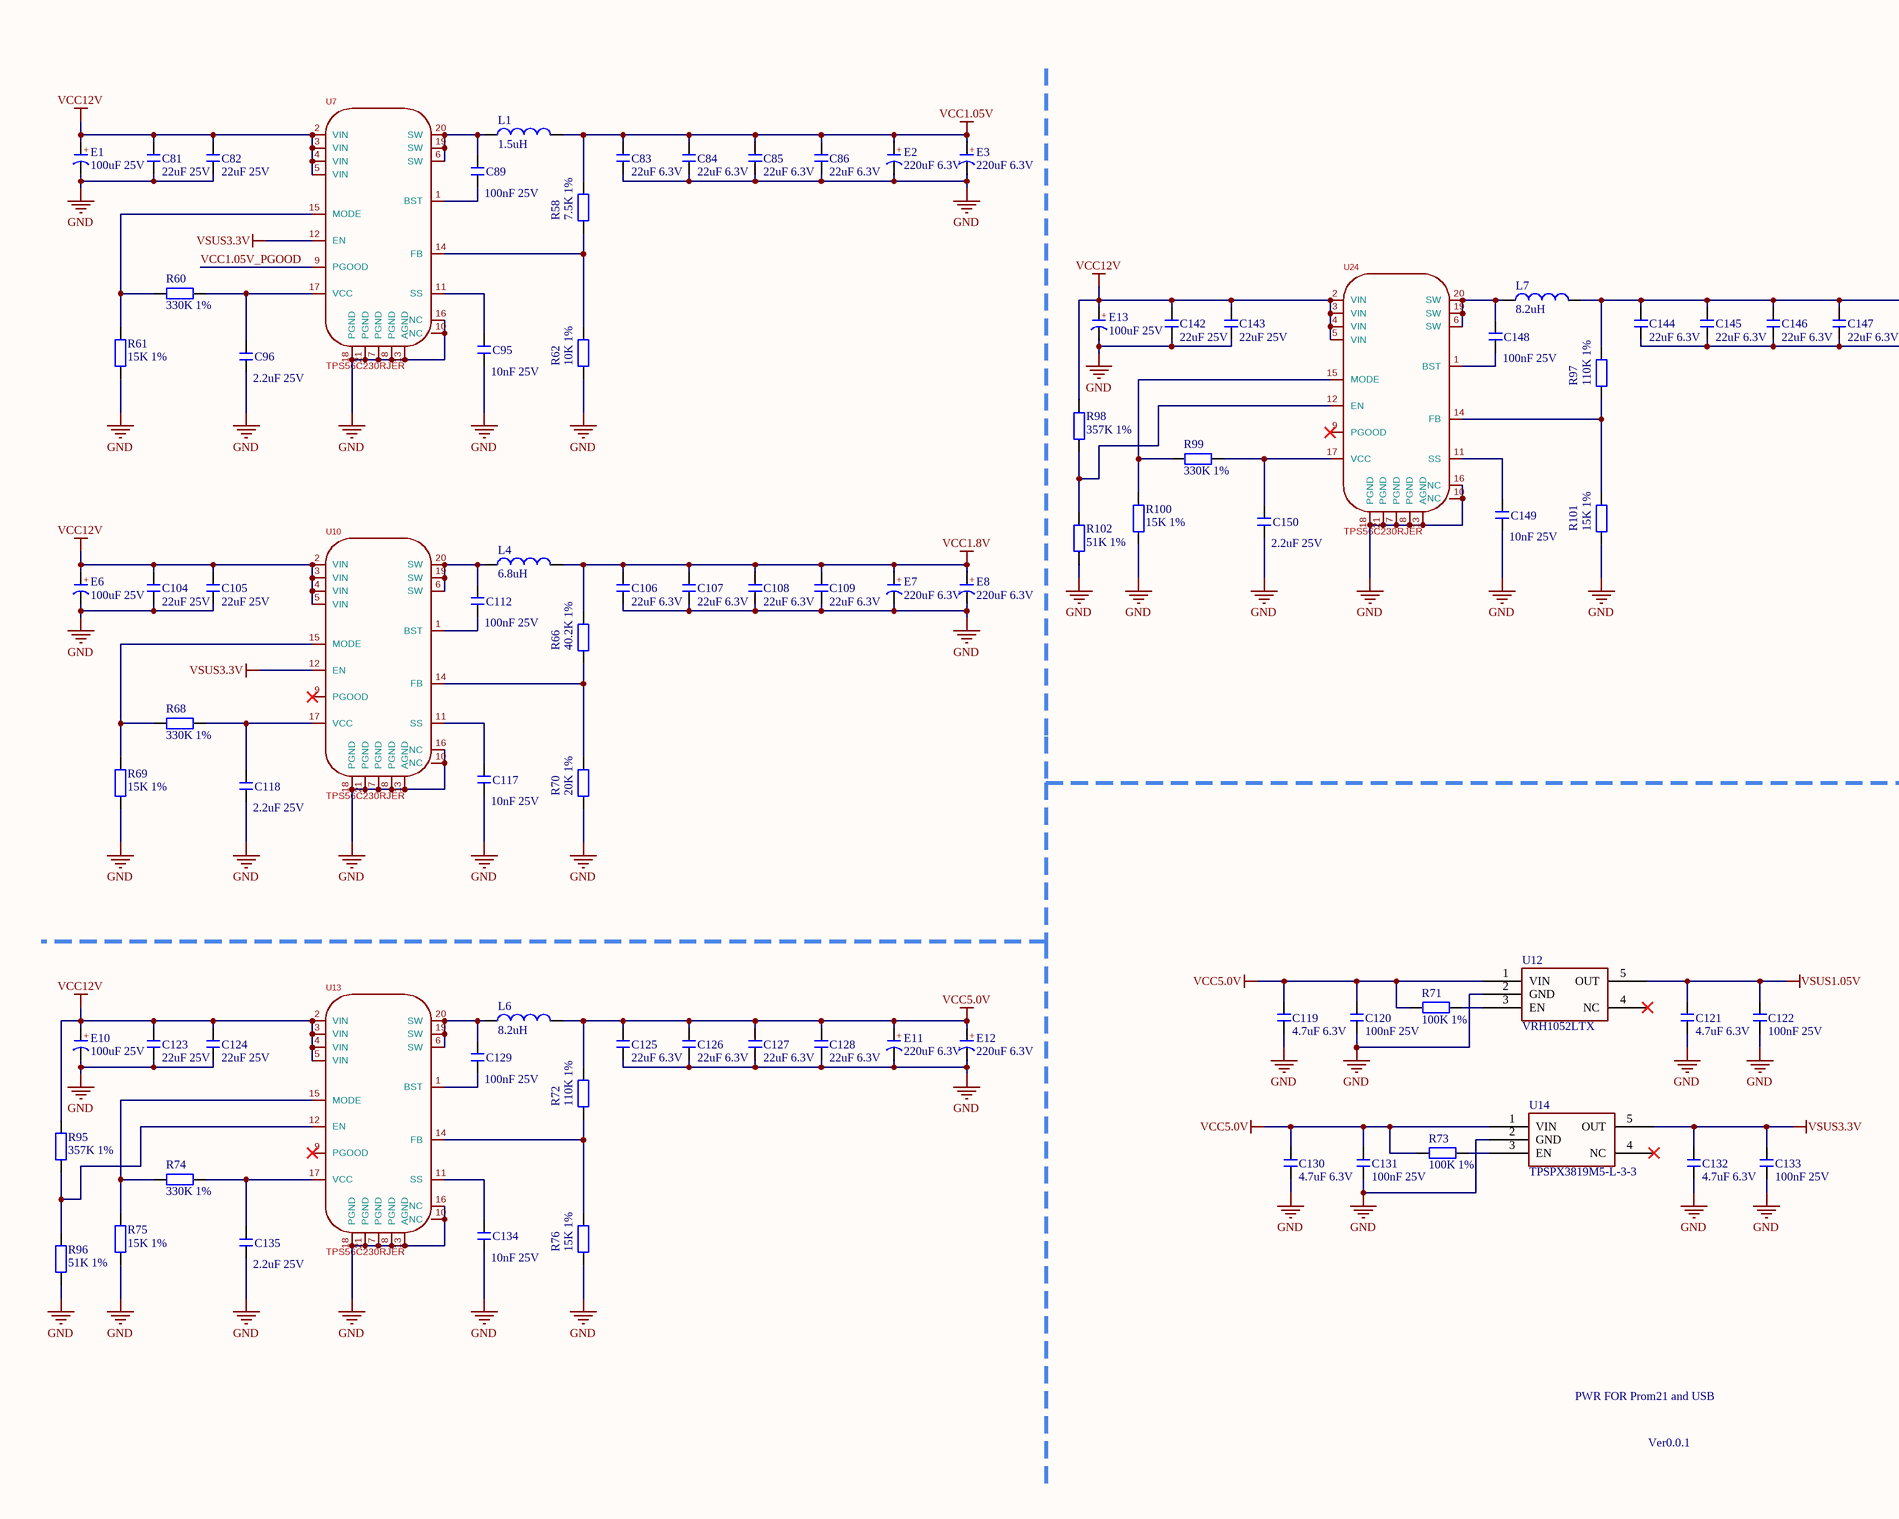
[diagram p5: pwr.SchDoc, left]
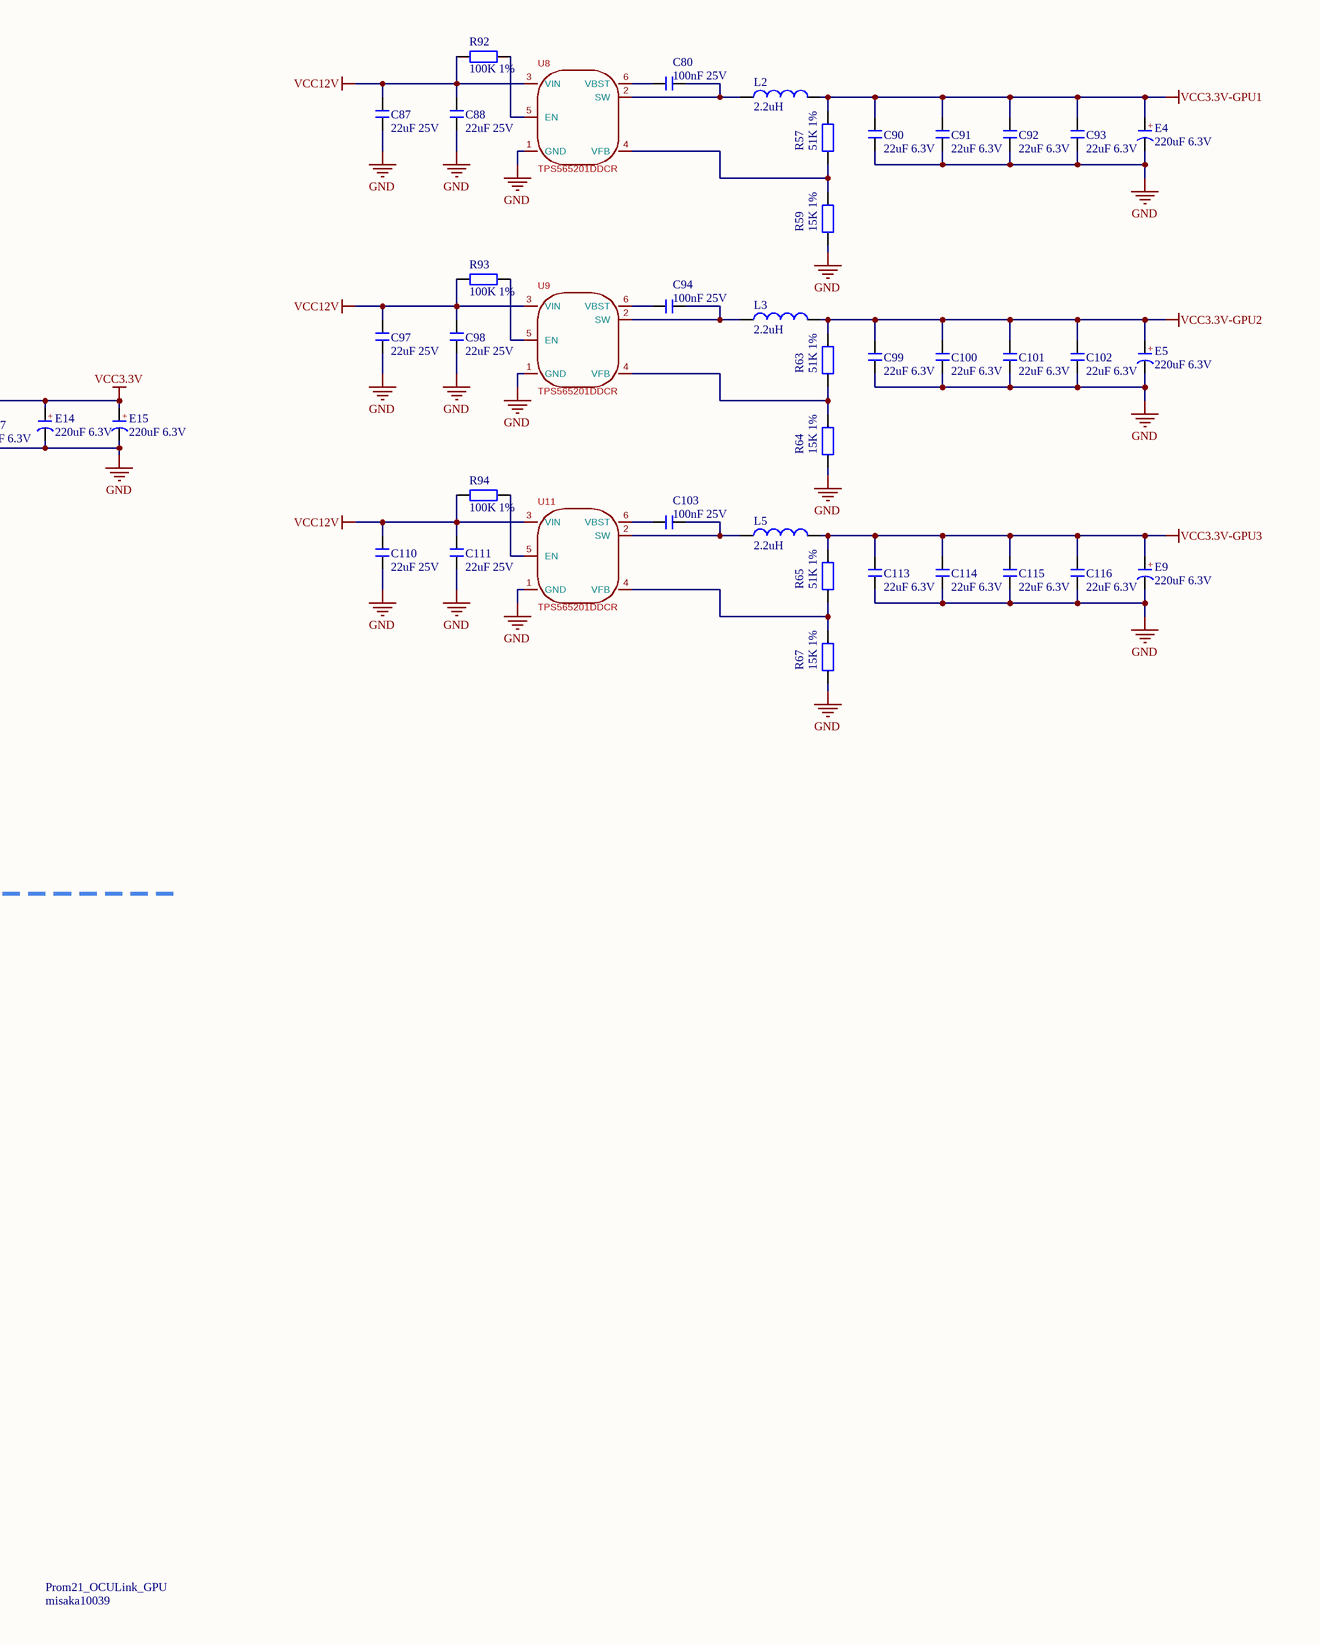
[diagram p6: pwr.SchDoc, right]

### Parts
C80  100nF 25V  [C0402_L]
C81  22uF 25V  [C0805_L]
C82  22uF 25V  [C0805_L]
C83  22uF 6.3V  [C0603_L]
C84  22uF 6.3V  [C0603_L]
C85  22uF 6.3V  [C0603_L]
C86  22uF 6.3V  [C0603_L]
C87  22uF 25V  [C0805_L]
C88  22uF 25V  [C0805_L]
C89  100nF 25V  [C0402_L]
C90  22uF 6.3V  [C0603_L]
C91  22uF 6.3V  [C0603_L]
C92  22uF 6.3V  [C0603_L]
C93  22uF 6.3V  [C0603_L]
C94  100nF 25V  [C0402_L]
C95  10nF 25V  [C0402_L]
C96  2.2uF 25V  [C0402_L]
C97  22uF 25V  [C0805_L]
C98  22uF 25V  [C0805_L]
C99  22uF 6.3V  [C0603_L]
C100  22uF 6.3V  [C0603_L]
C101  22uF 6.3V  [C0603_L]
C102  22uF 6.3V  [C0603_L]
C103  100nF 25V  [C0402_L]
C104  22uF 25V  [C0805_L]
C105  22uF 25V  [C0805_L]
C106  22uF 6.3V  [C0603_L]
C107  22uF 6.3V  [C0603_L]
C108  22uF 6.3V  [C0603_L]
C109  22uF 6.3V  [C0603_L]
C110  22uF 25V  [C0805_L]
C111  22uF 25V  [C0805_L]
C112  100nF 25V  [C0402_L]
C113  22uF 6.3V  [C0603_L]
C114  22uF 6.3V  [C0603_L]
C115  22uF 6.3V  [C0603_L]
C116  22uF 6.3V  [C0603_L]
C117  10nF 25V  [C0402_L]
C118  2.2uF 25V  [C0402_L]
C119  4.7uF 6.3V  [C0402_L]
C120  100nF 25V  [C0402_L]
C121  4.7uF 6.3V  [C0402_L]
C122  100nF 25V  [C0402_L]
C123  22uF 25V  [C0805_L]
C124  22uF 25V  [C0805_L]
C125  22uF 6.3V  [C0603_L]
C126  22uF 6.3V  [C0603_L]
C127  22uF 6.3V  [C0603_L]
C128  22uF 6.3V  [C0603_L]
C129  100nF 25V  [C0402_L]
C130  4.7uF 6.3V  [C0402_L]
C131  100nF 25V  [C0402_L]
C132  4.7uF 6.3V  [C0402_L]
C133  100nF 25V  [C0402_L]
C134  10nF 25V  [C0402_L]
C135  2.2uF 25V  [C0402_L]
C142  22uF 25V  [C0805_L]
C143  22uF 25V  [C0805_L]
C144  22uF 6.3V  [C0603_L]
C145  22uF 6.3V  [C0603_L]
C146  22uF 6.3V  [C0603_L]
C147  22uF 6.3V  [C0603_L]
C148  100nF 25V  [C0402_L]
C149  10nF 25V  [C0402_L]
C150  2.2uF 25V  [C0402_L]
E1  100uF 25V  [CT 6*4 - R]
E2  220uF 6.3V  [CT 6*4 - C]
E3  220uF 6.3V  [CT 6*4 - C]
E4  220uF 6.3V  [CT 6*4 - C]
E5  220uF 6.3V  [CT 6*4 - C]
E6  100uF 25V  [CT 6*4 - R]
E7  220uF 6.3V  [CT 6*4 - C]
E8  220uF 6.3V  [CT 6*4 - C]
E9  220uF 6.3V  [CT 6*4 - C]
E10  100uF 25V  [CT 6*4 - R]
E11  220uF 6.3V  [CT 6*4 - C]
E12  220uF 6.3V  [CT 6*4 - C]
E13  100uF 25V  [CT 6*4 - R]
E14  220uF 6.3V  [CT 6*4 - C]
E15  220uF 6.3V  [CT 6*4 - C]
L1  1.5uH  [L0630贴片电感]
L2  2.2uH  [L0630贴片电感]
L3  2.2uH  [L0630贴片电感]
L4  6.8uH  [L0630贴片电感]
L5  2.2uH  [L0630贴片电感]
L6  8.2uH  [L0630贴片电感]
L7  8.2uH  [L0630贴片电感]
R57  51K 1%  [R0402_L]
R58  7.5K 1%  [R0402_L]
R59  15K 1%  [R0402_L]
R60  330K 1%  [R0402_L]
R61  15K 1%  [R0402_L]
R62  10K 1%  [R0402_L]
R63  51K 1%  [R0402_L]
R64  15K 1%  [R0402_L]
R65  51K 1%  [R0402_L]
R66  40.2K 1%  [R0402_L]
R67  15K 1%  [R0402_L]
R68  330K 1%  [R0402_L]
R69  15K 1%  [R0402_L]
R70  20K 1%  [R0402_L]
R71  100K 1%  [R0402_L]
R72  110K 1%  [R0402_L]
R73  100K 1%  [R0402_L]
R74  330K 1%  [R0402_L]
R75  15K 1%  [R0402_L]
R76  15K 1%  [R0402_L]
R92  100K 1%  [R0402_L]
R93  100K 1%  [R0402_L]
R94  100K 1%  [R0402_L]
R95  357K 1%  [R0402_L]
R96  51K 1%  [R0402_L]
R97  110K 1%  [R0402_L]
R98  357K 1%  [R0402_L]
R99  330K 1%  [R0402_L]
R100  15K 1%  [R0402_L]
R101  15K 1%  [R0402_L]
R102  51K 1%  [R0402_L]
U7  TPS56C230RJER  [VQFN-20_L3.0-W3.0-P0.45-TL-EP_TI_RJE]
U8  TPS565201DDCR  [SOT23-6L]
U9  TPS565201DDCR  [SOT23-6L]
U10  TPS56C230RJER  [VQFN-20_L3.0-W3.0-P0.45-TL-EP_TI_RJE]
U11  TPS565201DDCR  [SOT23-6L]
U12  VRH1052LTX  [SOT23-5L]
U13  TPS56C230RJER  [VQFN-20_L3.0-W3.0-P0.45-TL-EP_TI_RJE]
U14  TPSPX3819M5-L-3-3  [SOT23-5L]
U24  TPS56C230RJER  [VQFN-20_L3.0-W3.0-P0.45-TL-EP_TI_RJE]

### Nets
GND: C81.1 C82.1 C83.1 C84.1 C85.1 C86.1 C87.1 C88.1 C90.1 C91.1 C92.1 C93.1 C95.1 C96.1 C97.1 C98.1 C99.1 C100.1 C101.1 C102.1 C104.1 C105.1 C106.1 C107.1 C108.1 C109.1 C110.1 C111.1 C113.1 C114.1 C115.1 C116.1 C117.1 C118.1 C119.1 C120.2 C121.1 C122.2 C123.1 C124.1 C125.1 C126.1 C127.1 C128.1 C130.1 C131.2 C132.1 C133.2 C134.1 C135.1 C142.1 C143.1 C144.1 C145.1 C146.1 C147.1 C149.1 C150.1 E1.2(K) E2.2(K) E3.2(K) E4.2(K) E5.2(K) E6.2(K) E7.2(K) E8.2(K) E9.2(K) E10.2(K) E11.2(K) E12.2(K) E13.2(K) E14.2(K) E15.2(K) R59.2 R61.1 R62.2 R64.2 R67.2 R69.1 R70.2 R75.1 R76.2 R96.1 R100.1 R101.2 R102.1 U7.7(PGND) U7.8(PGND) U7.10(NC) U7.13(AGND) U7.16(NC) U7.18(PGND) U7.21(PGND) U8.1(GND) U9.1(GND) U10.7(PGND) U10.8(PGND) U10.10(NC) U10.13(AGND) U10.16(NC) U10.18(PGND) U10.21(PGND) U11.1(GND) U12.2(GND) U13.7(PGND) U13.8(PGND) U13.10(NC) U13.13(AGND) U13.16(NC) U13.18(PGND) U13.21(PGND) U14.2(GND) U24.7(PGND) U24.8(PGND) U24.10(NC) U24.13(AGND) U24.16(NC) U24.18(PGND) U24.21(PGND)
VCC1.05V: C83.2 C84.2 C85.2 C86.2 E2.1(A) E3.1(A) L1.2 R58.1
VCC1.8V: C106.2 C107.2 C108.2 C109.2 E7.1(A) E8.1(A) L4.2 R66.1
VCC3.3V: C144.2 C145.2 C146.2 C147.2 E14.1(A) E15.1(A) L7.2 R97.1
VCC3.3V-GPU1: C90.2 C91.2 C92.2 C93.2 E4.1(A) L2.2 R57.1
VCC3.3V-GPU2: C99.2 C100.2 C101.2 C102.2 E5.1(A) L3.2 R63.1
VCC3.3V-GPU3: C113.2 C114.2 C115.2 C116.2 E9.1(A) L5.2 R65.1
VCC5.0V: C119.2 C120.1 C125.2 C126.2 C127.2 C128.2 C130.2 C131.1 E11.1(A) E12.1(A) L6.2 R71.2 R72.1 R73.2 U12.1(VIN) U14.1(VIN)
VCC12V: C81.2 C82.2 C87.2 C88.2 C97.2 C98.2 C104.2 C105.2 C110.2 C111.2 C123.2 C124.2 C142.2 C143.2 E1.1(A) E6.1(A) E10.1(A) E13.1(A) R92.1 R93.1 R94.1 R95.2 R98.2 U7.2(VIN) U7.3(VIN) U7.4(VIN) U7.5(VIN) U8.3(VIN) U9.3(VIN) U10.2(VIN) U10.3(VIN) U10.4(VIN) U10.5(VIN) U11.3(VIN) U13.2(VIN) U13.3(VIN) U13.4(VIN) U13.5(VIN) U24.2(VIN) U24.3(VIN) U24.4(VIN) U24.5(VIN)
VSUS1.05V: C121.2 C122.1 U12.5(OUT)
VSUS3.3V: C132.2 C133.1 U7.12(EN) U10.12(EN) U14.5(OUT)
VCC1.05V_PGOOD: U7.9(PGOOD)
NetC80_1: C80.1 L2.1 U8.2(SW)
NetC80_2: C80.2 U8.6(VBST)
NetC89_1: C89.1 U7.1(BST)
NetC89_2: C89.2 L1.1 U7.6(SW) U7.19(SW) U7.20(SW)
NetC94_1: C94.1 L3.1 U9.2(SW)
NetC94_2: C94.2 U9.6(VBST)
NetC95_2: C95.2 U7.11(SS)
NetC96_2: C96.2 R60.1 U7.17(VCC)
NetC103_1: C103.1 L5.1 U11.2(SW)
NetC103_2: C103.2 U11.6(VBST)
NetC112_1: C112.1 U10.1(BST)
NetC112_2: C112.2 L4.1 U10.6(SW) U10.19(SW) U10.20(SW)
NetC117_2: C117.2 U10.11(SS)
NetC118_2: C118.2 R68.1 U10.17(VCC)
NetC129_1: C129.1 U13.1(BST)
NetC129_2: C129.2 L6.1 U13.6(SW) U13.19(SW) U13.20(SW)
NetC134_2: C134.2 U13.11(SS)
NetC135_2: C135.2 R74.1 U13.17(VCC)
NetC148_1: C148.1 U24.1(BST)
NetC148_2: C148.2 L7.1 U24.6(SW) U24.19(SW) U24.20(SW)
NetC149_2: C149.2 U24.11(SS)
NetC150_2: C150.2 R99.1 U24.17(VCC)
NetR57_2: R57.2 R59.1 U8.4(VFB)
NetR58_2: R58.2 R62.1 U7.14(FB)
NetR60_2: R60.2 R61.2 U7.15(MODE)
NetR63_2: R63.2 R64.1 U9.4(VFB)
NetR65_2: R65.2 R67.1 U11.4(VFB)
NetR66_2: R66.2 R70.1 U10.14(FB)
NetR68_2: R68.2 R69.2 U10.15(MODE)
NetR71_1: R71.1 U12.3(EN)
NetR72_2: R72.2 R76.1 U13.14(FB)
NetR73_1: R73.1 U14.3(EN)
NetR74_2: R74.2 R75.2 U13.15(MODE)
NetR92_2: R92.2 U8.5(EN)
NetR93_2: R93.2 U9.5(EN)
NetR94_2: R94.2 U11.5(EN)
NetR95_1: R95.1 R96.2 U13.12(EN)
NetR97_2: R97.2 R101.1 U24.14(FB)
NetR98_1: R98.1 R102.2 U24.12(EN)
NetR99_2: R99.2 R100.2 U24.15(MODE)

Not connected (* = marked no-connect by the designer): U10 9(PGOOD)*; U12 4(NC)*; U13 9(PGOOD)*; U14 4(NC)*; U24 9(PGOOD)*

### Notes on the sheet
- PWR FOR Prom21 and USB
- Ver0.0.1
- Prom21_OCULink_GPU
- misaka10039
- (in symbol C-CAP) +

### Library data of the parts
C80-C135 C142-C150 = C: 无极性贴片电容; 版权归属: 源创客; 材质: X7R; BOM名称: 无极性贴片电容; 学习资源: www.ooocke.com
E1-E15 = C-CAP: 贴片电解电容; BOM名称: 直插电解电容; 版权归属: 源创客; 学习资源: www.ooocke.com
L1-L7 = L: 小功率贴片电感; 版权归属: 源创客; BOM名称: 小功率贴片电感; 学习资源: www.ooocke.com
R57-R76 R92-R102 = R: 贴片电阻; 版权归属: 源创客; BOM名称: 贴片电阻; 学习资源: www.ooocke.com
U7 U10 U13 U24 = TPS56C230RJER: 功能类型:降压型;输出类型:可调;输入电压:4.5V~18V;输出电压:600mV~5.5V;输出电流(最大值):12A;; Manufacturer: TI(德州仪器); AddInBom: yes; Function: 降压型; Output Type: 可调; Output Current (Max): 12A; Switching Frequency: 500kHz; Synchronous Rectification: 是; Number of Outputs: 1; Topology: 降压式; Switch tube (built-in/external): 内置; ModelId: a0d54152b84047e092cea8f9e273e78e; ModelTransform: 118.8974,118.8974,0,0,0,0,0,0,0; Symbol: TPS56C230RJER; Device: TPS56C230RJER; Supplier: LCSC; SupplierPart: C1849534; ManufacturerPart: TPS56C230RJER; JLCPCB Part Class: 扩展库; LCSC Part Name: TPS56C230RJER; Supplier Footprint: VQFN-20-EP(3x3); Datasheet: https://www.ti.com/cn/lit/gpn/tps56c230; ConvertToPcb: yes; Input Voltage: 4.5V~18V; Output Voltage: 600mV~5.5V; Operating Temperature: -40℃~+125℃@(TJ); FootprintName: VQFN-20_L3.0-W3.0-P0.45-TL-EP_TI_RJE; ModelName: VQFN-20_L3.0-W3.0-P0.45-TL-EP_TI_RJE
U8 U9 U11 = TPS565201DDCR: 功能类型:降压型;输出类型:可调;输入电压:4.5V~17V;输出电压:600mV~7V;输出电流(最大值):5A;; Manufacturer: TI(德州仪器); AddInBom: yes; Function: 降压型; Output Type: 可调; Output Current (Max): 5A; Switching Frequency: 500kHz; Synchronous Rectification: 是; Number of Outputs: 1; Topology: 降压式; Switch tube (built-in/external): 内置; ModelId: 2c4039b5b88644c1bda4b4ba9e971667; ModelName: TSOT-23-6_L2.9-W1.6-H1.1-LS2.8-P0.95; ModelTransform: 110.236,114.173,0,90,0,0,0,0,0; Device: TPS565201DDCR; LCSC Part Name: TPS565201DDCR; SupplierPart: C327676; ManufacturerPart: TPS565201DDCR; Supplier Footprint: TSOT-23-6; JLCPCB Part Class: 扩展库; Supplier: LCSC; ConvertToPcb: yes; Input Voltage: 4.5V~17V; Output Voltage: 600mV~7V; Operating Temperature: -40℃~+125℃@(TJ); SymbolName: TPS565201DDCR; FootprintName: TSOT-23-6_L2.9-W1.6-P0.95-LS2.8-BL
U12 U14 = LP5907_MFX: SOT-23-5

## Sheet USB.SchDoc
size 580 x 240 mm; SheetNumber: 5; SheetTotal: 6
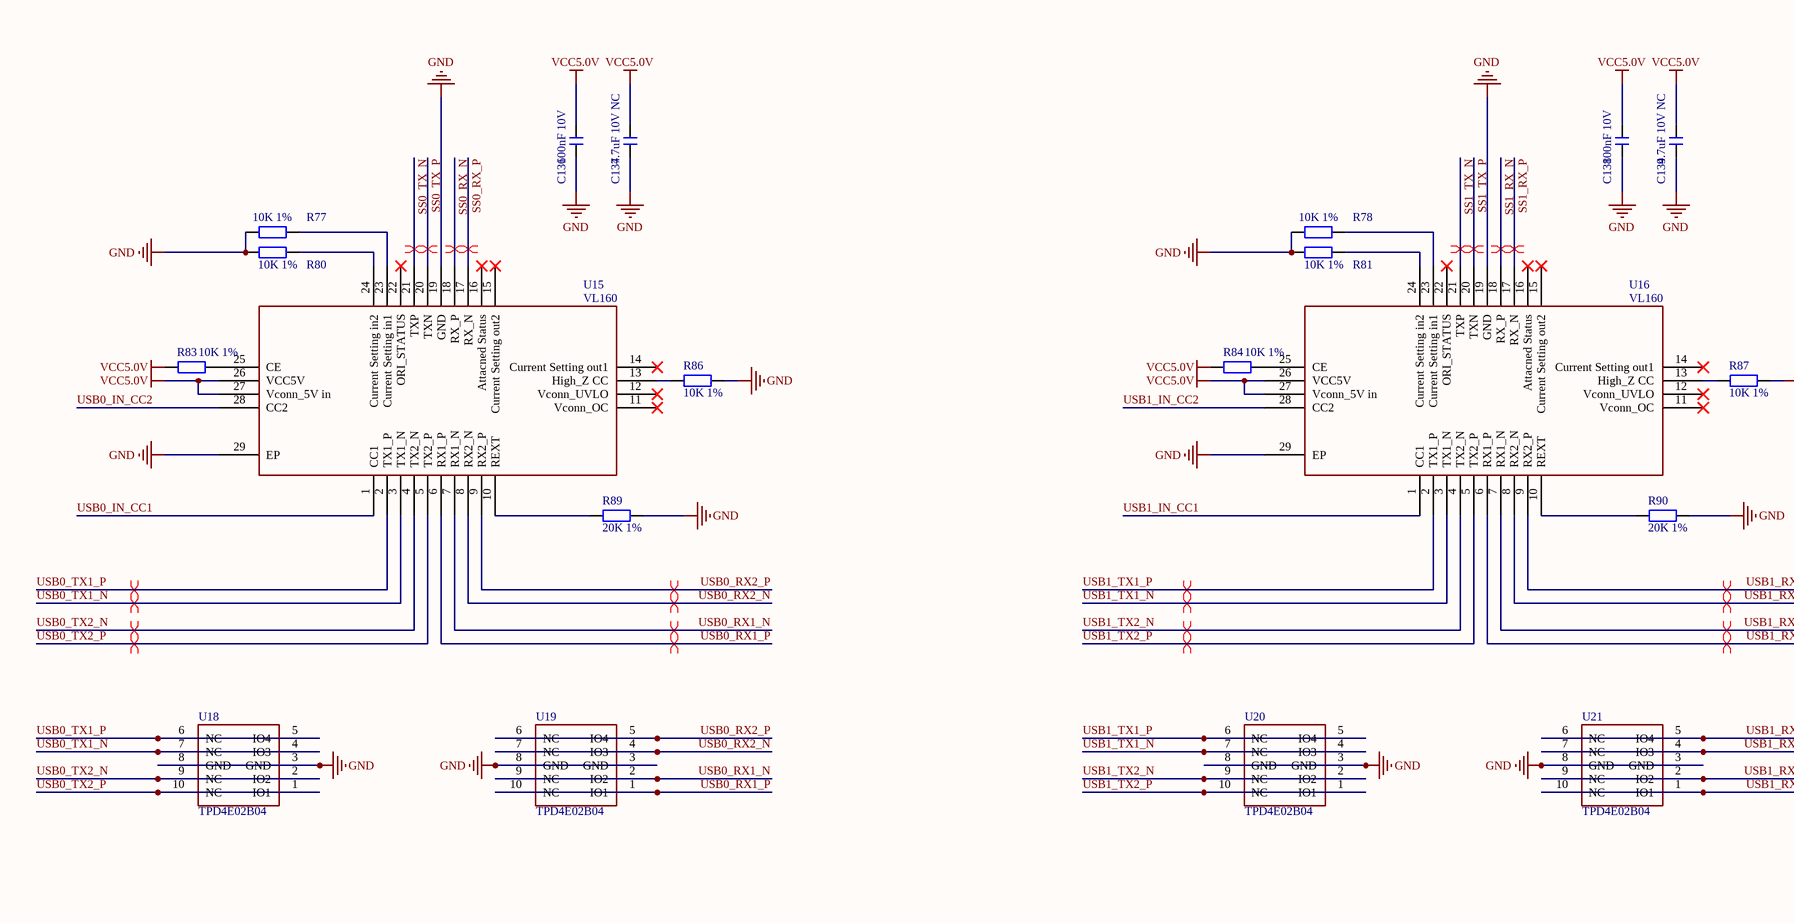
[diagram p7: USB.SchDoc, left]
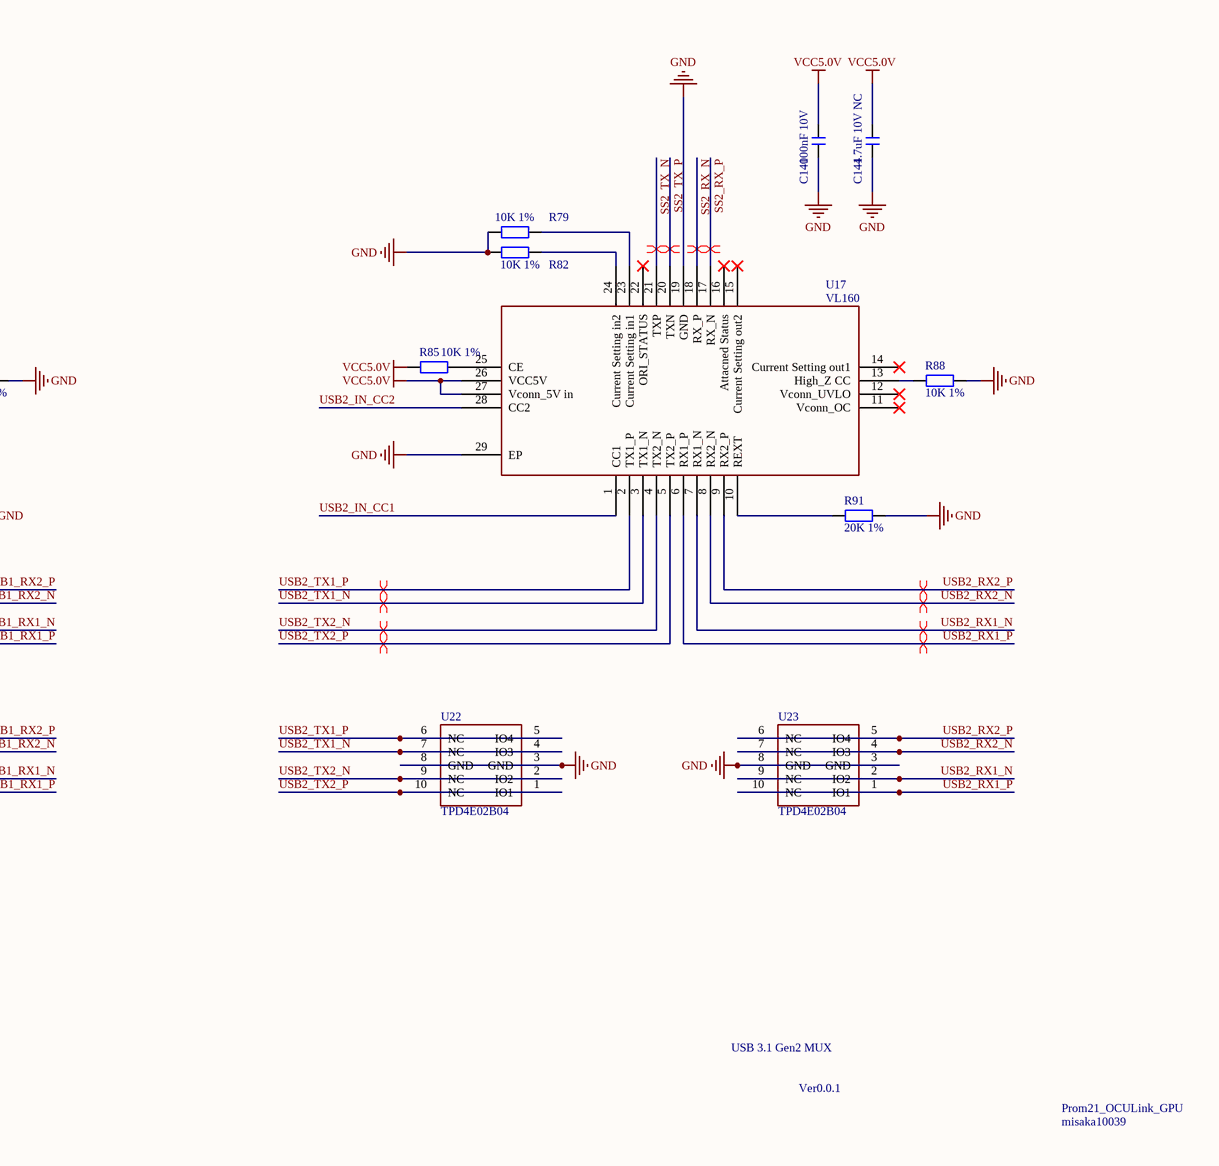
[diagram p8: USB.SchDoc, right]

### Parts
C136  100nF 10V  [C0402_L]
C137  4.7uF 10V NC  [C0402_L]
C138  100nF 10V  [C0402_L]
C139  4.7uF 10V NC  [C0402_L]
C140  100nF 10V  [C0402_L]
C141  4.7uF 10V NC  [C0402_L]
R77  10K 1%  [R0402_L]
R78  10K 1%  [R0402_L]
R79  10K 1%  [R0402_L]
R80  10K 1%  [R0402_L]
R81  10K 1%  [R0402_L]
R82  10K 1%  [R0402_L]
R83  10K 1%  [R0402_L]
R84  10K 1%  [R0402_L]
R85  10K 1%  [R0402_L]
R86  10K 1%  [R0402_L]
R87  10K 1%  [R0402_L]
R88  10K 1%  [R0402_L]
R89  20K 1%  [R0402_L]
R90  20K 1%  [R0402_L]
R91  20K 1%  [R0402_L]
U15  VL160  [MQFN-28_L4.5-W3.5-P0.40-BL-EP]
U16  VL160  [MQFN-28_L4.5-W3.5-P0.40-BL-EP]
U17  VL160  [MQFN-28_L4.5-W3.5-P0.40-BL-EP]
U18  TPD4E02B04  [DIO_TPD4E02B04DQAR]
U19  TPD4E02B04  [DIO_TPD4E02B04DQAR]
U20  TPD4E02B04  [DIO_TPD4E02B04DQAR]
U21  TPD4E02B04  [DIO_TPD4E02B04DQAR]
U22  TPD4E02B04  [DIO_TPD4E02B04DQAR]
U23  TPD4E02B04  [DIO_TPD4E02B04DQAR]

### Nets
GND: C136.1 C137.1 C138.1 C139.1 C140.1 C141.1 R77.1 R78.1 R79.1 R80.1 R81.1 R82.1 R86.1 R87.1 R88.1 R89.1 R90.1 R91.1 U15.19(GND) U15.29(EP) U16.19(GND) U16.29(EP) U17.19(GND) U17.29(EP) U18.3(GND) U18.8(GND) U19.3(GND) U19.8(GND) U20.3(GND) U20.8(GND) U21.3(GND) U21.8(GND) U22.3(GND) U22.8(GND) U23.3(GND) U23.8(GND)
VCC5.0V: C136.2 C137.2 C138.2 C139.2 C140.2 C141.2 R83.2 R84.2 R85.2 U15.26(VCC5V) U15.27(Vconn_5V_in) U16.26(VCC5V) U16.27(Vconn_5V_in) U17.26(VCC5V) U17.27(Vconn_5V_in)
SS0_RX_N: U15.18(RX_P)
SS0_RX_P: U15.17(RX_N)
SS0_TX_N: U15.21(TXP)
SS0_TX_P: U15.20(TXN)
SS1_RX_N: U16.18(RX_P)
SS1_RX_P: U16.17(RX_N)
SS1_TX_N: U16.21(TXP)
SS1_TX_P: U16.20(TXN)
SS2_RX_N: U17.18(RX_P)
SS2_RX_P: U17.17(RX_N)
SS2_TX_N: U17.21(TXP)
SS2_TX_P: U17.20(TXN)
USB0_IN_CC1: U15.1(CC1)
USB0_IN_CC2: U15.28(CC2)
USB0_RX1_N: U15.7(RX1_N) U19.2(IO2) U19.9(NC)
USB0_RX1_P: U15.6(RX1_P) U19.1(IO1) U19.10(NC)
USB0_RX2_N: U15.8(RX2_N) U19.4(IO3) U19.7(NC)
USB0_RX2_P: U15.9(RX2_P) U19.5(IO4) U19.6(NC)
USB0_TX1_N: U15.3(TX1_N) U18.4(IO3) U18.7(NC)
USB0_TX1_P: U15.2(TX1_P) U18.5(IO4) U18.6(NC)
USB0_TX2_N: U15.4(TX2_N) U18.2(IO2) U18.9(NC)
USB0_TX2_P: U15.5(TX2_P) U18.1(IO1) U18.10(NC)
USB1_IN_CC1: U16.1(CC1)
USB1_IN_CC2: U16.28(CC2)
USB1_RX1_N: U16.7(RX1_N) U21.2(IO2) U21.9(NC)
USB1_RX1_P: U16.6(RX1_P) U21.1(IO1) U21.10(NC)
USB1_RX2_N: U16.8(RX2_N) U21.4(IO3) U21.7(NC)
USB1_RX2_P: U16.9(RX2_P) U21.5(IO4) U21.6(NC)
USB1_TX1_N: U16.3(TX1_N) U20.4(IO3) U20.7(NC)
USB1_TX1_P: U16.2(TX1_P) U20.5(IO4) U20.6(NC)
USB1_TX2_N: U16.4(TX2_N) U20.2(IO2) U20.9(NC)
USB1_TX2_P: U16.5(TX2_P) U20.1(IO1) U20.10(NC)
USB2_IN_CC1: U17.1(CC1)
USB2_IN_CC2: U17.28(CC2)
USB2_RX1_N: U17.7(RX1_N) U23.2(IO2) U23.9(NC)
USB2_RX1_P: U17.6(RX1_P) U23.1(IO1) U23.10(NC)
USB2_RX2_N: U17.8(RX2_N) U23.4(IO3) U23.7(NC)
USB2_RX2_P: U17.9(RX2_P) U23.5(IO4) U23.6(NC)
USB2_TX1_N: U17.3(TX1_N) U22.4(IO3) U22.7(NC)
USB2_TX1_P: U17.2(TX1_P) U22.5(IO4) U22.6(NC)
USB2_TX2_N: U17.4(TX2_N) U22.2(IO2) U22.9(NC)
USB2_TX2_P: U17.5(TX2_P) U22.1(IO1) U22.10(NC)
NetR77_2: R77.2 U15.23(Current_Setting_in1)
NetR78_2: R78.2 U16.23(Current_Setting_in1)
NetR79_2: R79.2 U17.23(Current_Setting_in1)
NetR80_2: R80.2 U15.24(Current_Setting_in2)
NetR81_2: R81.2 U16.24(Current_Setting_in2)
NetR82_2: R82.2 U17.24(Current_Setting_in2)
NetR83_1: R83.1 U15.25(CE)
NetR84_1: R84.1 U16.25(CE)
NetR85_1: R85.1 U17.25(CE)
NetR86_2: R86.2 U15.13(High_Z_CC)
NetR87_2: R87.2 U16.13(High_Z_CC)
NetR88_2: R88.2 U17.13(High_Z_CC)
NetR89_2: R89.2 U15.10(REXT)
NetR90_2: R90.2 U16.10(REXT)
NetR91_2: R91.2 U17.10(REXT)

Not connected (* = marked no-connect by the designer): U15 11(Vconn_OC)* 12(Vconn_UVLO)* 14(Current_Setting_out1)* 15(Current_Setting_out2)* 16(Attacned_Status)* 22(ORI_STATUS)*; U16 11(Vconn_OC)* 12(Vconn_UVLO)* 14(Current_Setting_out1)* 15(Current_Setting_out2)* 16(Attacned_Status)* 22(ORI_STATUS)*; U17 11(Vconn_OC)* 12(Vconn_UVLO)* 14(Current_Setting_out1)* 15(Current_Setting_out2)* 16(Attacned_Status)* 22(ORI_STATUS)*

### Layout directives
differential pair: SS0_RX_N, SS0_RX_P, SS0_TX_N, SS0_TX_P, SS1_RX_N, SS1_RX_P, SS1_TX_N, SS1_TX_P, SS2_RX_N, SS2_RX_P, SS2_TX_N, SS2_TX_P, USB0_RX1_N, USB0_RX1_P, USB0_RX2_N, USB0_RX2_P, USB0_TX1_N, USB0_TX1_P, USB0_TX2_N, USB0_TX2_P, USB1_RX1_N, USB1_RX1_P, USB1_RX2_N, USB1_RX2_P, USB1_TX1_N, USB1_TX1_P, USB1_TX2_N, USB1_TX2_P, USB2_RX1_N, USB2_RX1_P, USB2_RX2_N, USB2_RX2_P, USB2_TX1_N, USB2_TX1_P, USB2_TX2_N, USB2_TX2_P

### Notes on the sheet
- USB 3.1 Gen2 MUX
- Ver0.0.1
- Prom21_OCULink_GPU
- misaka10039

### Library data of the parts
C136-C141 = C: 无极性贴片电容; 版权归属: 源创客; 材质: X7R; BOM名称: 无极性贴片电容; 学习资源: www.ooocke.com
R77-R91 = R: 贴片电阻; 版权归属: 源创客; BOM名称: 贴片电阻; 学习资源: www.ooocke.com
U18-U23 = TPD4E02B04: ESD

## Sheet Signal.SchDoc
size A4; SheetNumber: 6; SheetTotal: 6
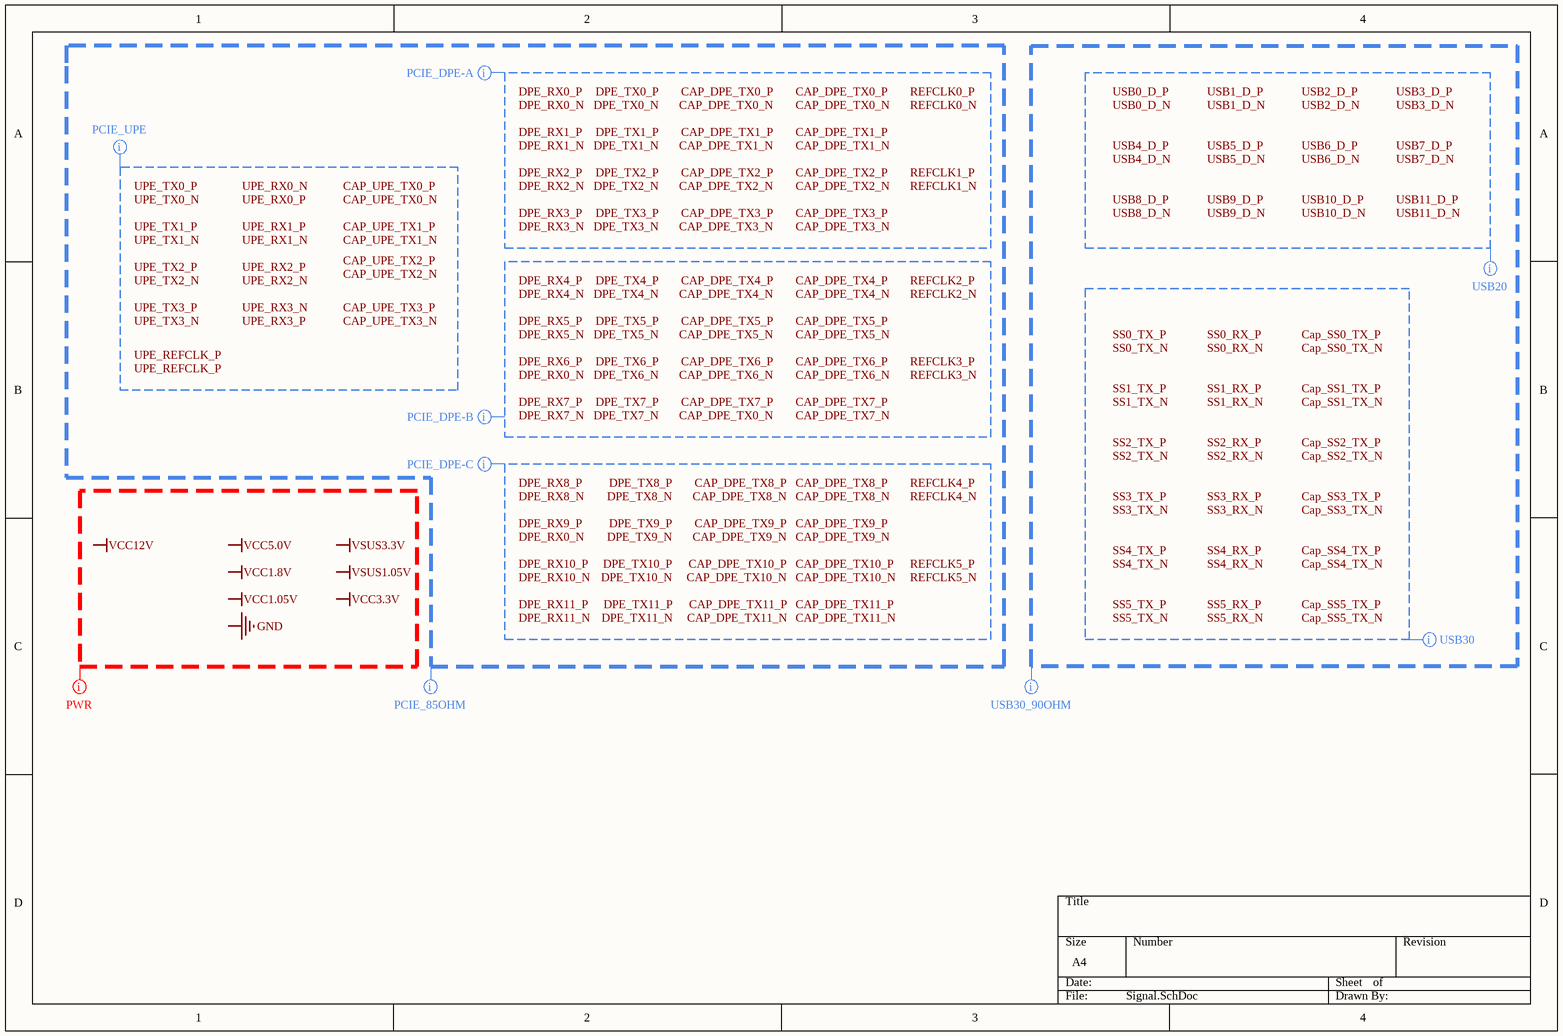
[diagram p9: Signal.SchDoc]

### Layout directives
net class PCIE_UPE: CAP_UPE_TX0_N, CAP_UPE_TX0_P, CAP_UPE_TX1_N, CAP_UPE_TX1_P, CAP_UPE_TX2_N, CAP_UPE_TX2_P, CAP_UPE_TX3_N, CAP_UPE_TX3_P, UPE_REFCLK_P, UPE_RX0_N, UPE_RX0_P, UPE_RX1_N, UPE_RX1_P, UPE_RX2_N, UPE_RX2_P, UPE_RX3_N, UPE_RX3_P, UPE_TX0_N, UPE_TX0_P, UPE_TX1_N, UPE_TX1_P, UPE_TX2_N, UPE_TX2_P, UPE_TX3_N, UPE_TX3_P
net class PCIE_DPE-A: CAP_DPE_TX0_N, CAP_DPE_TX0_P, CAP_DPE_TX1_N, CAP_DPE_TX1_P, CAP_DPE_TX2_N, CAP_DPE_TX2_P, CAP_DPE_TX3_N, CAP_DPE_TX3_P, DPE_RX0_N, DPE_RX0_P, DPE_RX1_N, DPE_RX1_P, DPE_RX2_N, DPE_RX2_P, DPE_RX3_N, DPE_RX3_P, DPE_TX0_N, DPE_TX0_P, DPE_TX1_N, DPE_TX1_P, DPE_TX2_N, DPE_TX2_P, DPE_TX3_N, DPE_TX3_P, REFCLK0_N, REFCLK0_P, REFCLK1_N, REFCLK1_P
net class PCIE_DPE-B: CAP_DPE_TX0_N, CAP_DPE_TX4_N, CAP_DPE_TX4_P, CAP_DPE_TX5_N, CAP_DPE_TX5_P, CAP_DPE_TX6_N, CAP_DPE_TX6_P, CAP_DPE_TX7_N, CAP_DPE_TX7_P, DPE_RX0_N, DPE_RX4_N, DPE_RX4_P, DPE_RX5_N, DPE_RX5_P, DPE_RX6_P, DPE_RX7_N, DPE_RX7_P, DPE_TX4_N, DPE_TX4_P, DPE_TX5_N, DPE_TX5_P, DPE_TX6_N, DPE_TX6_P, DPE_TX7_N, DPE_TX7_P, REFCLK2_N, REFCLK2_P, REFCLK3_N, REFCLK3_P
net class PCIE_DPE-C: CAP_DPE_TX8_N, CAP_DPE_TX8_P, CAP_DPE_TX9_N, CAP_DPE_TX9_P, CAP_DPE_TX10_N, CAP_DPE_TX10_P, CAP_DPE_TX11_N, CAP_DPE_TX11_P, DPE_RX0_N, DPE_RX8_N, DPE_RX8_P, DPE_RX9_P, DPE_RX10_N, DPE_RX10_P, DPE_RX11_N, DPE_RX11_P, DPE_TX8_N, DPE_TX8_P, DPE_TX9_N, DPE_TX9_P, DPE_TX10_N, DPE_TX10_P, DPE_TX11_N, DPE_TX11_P, REFCLK4_N, REFCLK4_P, REFCLK5_N, REFCLK5_P
rule Differential Pairs Routing [Pref Gap = 6mil    Min Gap  = 4mil    Max Gap  = 6milPref Width = 6.38mil    Min Width  = 4mil    Max Width  = 6.38mil]: CAP_DPE_TX0_N, CAP_DPE_TX0_P, CAP_DPE_TX1_N, CAP_DPE_TX1_P, CAP_DPE_TX2_N, CAP_DPE_TX2_P, CAP_DPE_TX3_N, CAP_DPE_TX3_P, CAP_DPE_TX4_N, CAP_DPE_TX4_P, CAP_DPE_TX5_N, CAP_DPE_TX5_P, CAP_DPE_TX6_N, CAP_DPE_TX6_P, CAP_DPE_TX7_N, CAP_DPE_TX7_P, CAP_DPE_TX8_N, CAP_DPE_TX8_P, CAP_DPE_TX9_N, CAP_DPE_TX9_P, CAP_DPE_TX10_N, CAP_DPE_TX10_P, CAP_DPE_TX11_N, CAP_DPE_TX11_P, CAP_UPE_TX0_N, CAP_UPE_TX0_P, CAP_UPE_TX1_N, CAP_UPE_TX1_P, CAP_UPE_TX2_N, CAP_UPE_TX2_P, CAP_UPE_TX3_N, CAP_UPE_TX3_P, DPE_RX0_N, DPE_RX0_P, DPE_RX1_N, DPE_RX1_P, DPE_RX2_N, DPE_RX2_P, DPE_RX3_N, DPE_RX3_P, DPE_RX4_N, DPE_RX4_P, DPE_RX5_N, DPE_RX5_P, DPE_RX6_P, DPE_RX7_N, DPE_RX7_P, DPE_RX8_N, DPE_RX8_P, DPE_RX9_P, DPE_RX10_N, DPE_RX10_P, DPE_RX11_N, DPE_RX11_P, DPE_TX0_N, DPE_TX0_P, DPE_TX1_N, DPE_TX1_P, DPE_TX2_N, DPE_TX2_P, DPE_TX3_N, DPE_TX3_P, DPE_TX4_N, DPE_TX4_P, DPE_TX5_N, DPE_TX5_P, DPE_TX6_N, DPE_TX6_P, DPE_TX7_N, DPE_TX7_P, DPE_TX8_N, DPE_TX8_P, DPE_TX9_N, DPE_TX9_P, DPE_TX10_N, DPE_TX10_P, DPE_TX11_N, DPE_TX11_P, REFCLK0_N, REFCLK0_P, REFCLK1_N, REFCLK1_P, REFCLK2_N, REFCLK2_P, REFCLK3_N, REFCLK3_P, REFCLK4_N, REFCLK4_P, REFCLK5_N, REFCLK5_P, UPE_REFCLK_P, UPE_RX0_N, UPE_RX0_P, UPE_RX1_N, UPE_RX1_P, UPE_RX2_N, UPE_RX2_P, UPE_RX3_N, UPE_RX3_P, UPE_TX0_N, UPE_TX0_P, UPE_TX1_N, UPE_TX1_P, UPE_TX2_N, UPE_TX2_P, UPE_TX3_N, UPE_TX3_P
net class PWR: GND, VCC1.05V, VCC1.8V, VCC3.3V, VCC5.0V, VCC12V, VSUS1.05V, VSUS3.3V
rule Differential Pairs Routing [Pref Gap = 6mil    Min Gap  = 4mil    Max Gap  = 6milPref Width = 5.59mil    Min Width  = 4mil    Max Width  = 5.59mil]: Cap_SS0_TX_N, Cap_SS0_TX_P, Cap_SS1_TX_N, Cap_SS1_TX_P, Cap_SS2_TX_N, Cap_SS2_TX_P, Cap_SS3_TX_N, Cap_SS3_TX_P, Cap_SS4_TX_N, Cap_SS4_TX_P, Cap_SS5_TX_N, Cap_SS5_TX_P, SS0_RX_N, SS0_RX_P, SS0_TX_N, SS0_TX_P, SS1_RX_N, SS1_RX_P, SS1_TX_N, SS1_TX_P, SS2_RX_N, SS2_RX_P, SS2_TX_N, SS2_TX_P, SS3_RX_N, SS3_RX_P, SS3_TX_N, SS3_TX_P, SS4_RX_N, SS4_RX_P, SS4_TX_N, SS4_TX_P, SS5_RX_N, SS5_RX_P, SS5_TX_N, SS5_TX_P, USB0_D_N, USB0_D_P, USB1_D_N, USB1_D_P, USB2_D_N, USB2_D_P, USB3_D_N, USB3_D_P, USB4_D_N, USB4_D_P, USB5_D_N, USB5_D_P, USB6_D_N, USB6_D_P, USB7_D_N, USB7_D_P, USB8_D_N, USB8_D_P, USB9_D_N, USB9_D_P, USB10_D_N, USB10_D_P, USB11_D_N, USB11_D_P
net class USB30: Cap_SS0_TX_N, Cap_SS0_TX_P, Cap_SS1_TX_N, Cap_SS1_TX_P, Cap_SS2_TX_N, Cap_SS2_TX_P, Cap_SS3_TX_N, Cap_SS3_TX_P, Cap_SS4_TX_N, Cap_SS4_TX_P, Cap_SS5_TX_N, Cap_SS5_TX_P, SS0_RX_N, SS0_RX_P, SS0_TX_N, SS0_TX_P, SS1_RX_N, SS1_RX_P, SS1_TX_N, SS1_TX_P, SS2_RX_N, SS2_RX_P, SS2_TX_N, SS2_TX_P, SS3_RX_N, SS3_RX_P, SS3_TX_N, SS3_TX_P, SS4_RX_N, SS4_RX_P, SS4_TX_N, SS4_TX_P, SS5_RX_N, SS5_RX_P, SS5_TX_N, SS5_TX_P
net class USB20: USB0_D_N, USB0_D_P, USB1_D_N, USB1_D_P, USB2_D_N, USB2_D_P, USB3_D_N, USB3_D_P, USB4_D_N, USB4_D_P, USB5_D_N, USB5_D_P, USB6_D_N, USB6_D_P, USB7_D_N, USB7_D_P, USB8_D_N, USB8_D_P, USB9_D_N, USB9_D_P, USB10_D_N, USB10_D_P, USB11_D_N, USB11_D_P

### Notes on the sheet
- Labels drawn without touching a wire or pin: CAP_DPE_TX0_N, CAP_DPE_TX0_P, CAP_DPE_TX1_N, CAP_DPE_TX1_P, CAP_DPE_TX2_N, CAP_DPE_TX2_P, CAP_DPE_TX3_N, CAP_DPE_TX3_P, CAP_DPE_TX4_N, CAP_DPE_TX4_P, CAP_DPE_TX5_N, CAP_DPE_TX5_P, CAP_DPE_TX6_N, CAP_DPE_TX6_P, CAP_DPE_TX7_N, CAP_DPE_TX7_P, CAP_DPE_TX8_N, CAP_DPE_TX8_P, CAP_DPE_TX9_N, CAP_DPE_TX9_P, CAP_DPE_TX10_N, CAP_DPE_TX10_P, CAP_DPE_TX11_N, CAP_DPE_TX11_P, Cap_SS0_TX_N, Cap_SS0_TX_P, Cap_SS1_TX_N, Cap_SS1_TX_P, Cap_SS2_TX_N, Cap_SS2_TX_P, Cap_SS3_TX_N, Cap_SS3_TX_P, Cap_SS4_TX_N, Cap_SS4_TX_P, Cap_SS5_TX_N, Cap_SS5_TX_P, CAP_UPE_TX0_N, CAP_UPE_TX0_P, CAP_UPE_TX1_N, CAP_UPE_TX1_P, CAP_UPE_TX2_N, CAP_UPE_TX2_P, CAP_UPE_TX3_N, CAP_UPE_TX3_P, DPE_RX0_N, DPE_RX0_P, DPE_RX1_N, DPE_RX1_P, DPE_RX2_N, DPE_RX2_P, DPE_RX3_N, DPE_RX3_P, DPE_RX4_N, DPE_RX4_P, DPE_RX5_N, DPE_RX5_P, DPE_RX6_P, DPE_RX7_N, DPE_RX7_P, DPE_RX8_N, DPE_RX8_P, DPE_RX9_P, DPE_RX10_N, DPE_RX10_P, DPE_RX11_N, DPE_RX11_P, DPE_TX0_N, DPE_TX0_P, DPE_TX1_N, DPE_TX1_P, DPE_TX2_N, DPE_TX2_P, DPE_TX3_N, DPE_TX3_P, DPE_TX4_N, DPE_TX4_P, DPE_TX5_N, DPE_TX5_P, DPE_TX6_N, DPE_TX6_P, DPE_TX7_N, DPE_TX7_P, DPE_TX8_N, DPE_TX8_P, DPE_TX9_N, DPE_TX9_P, DPE_TX10_N, DPE_TX10_P, DPE_TX11_N, DPE_TX11_P, GND, REFCLK0_N, REFCLK0_P, REFCLK1_N, REFCLK1_P, REFCLK2_N, REFCLK2_P, REFCLK3_N, REFCLK3_P, REFCLK4_N, REFCLK4_P, REFCLK5_N, REFCLK5_P, SS0_RX_N, SS0_RX_P, SS0_TX_N, SS0_TX_P, SS1_RX_N, SS1_RX_P, SS1_TX_N, SS1_TX_P, SS2_RX_N, SS2_RX_P, SS2_TX_N, SS2_TX_P, SS3_RX_N, SS3_RX_P, SS3_TX_N, SS3_TX_P, SS4_RX_N, SS4_RX_P, SS4_TX_N, SS4_TX_P, SS5_RX_N, SS5_RX_P, SS5_TX_N, SS5_TX_P, UPE_REFCLK_P, UPE_RX0_N, UPE_RX0_P, UPE_RX1_N, UPE_RX1_P, UPE_RX2_N, UPE_RX2_P, UPE_RX3_N, UPE_RX3_P, UPE_TX0_N, UPE_TX0_P, UPE_TX1_N, UPE_TX1_P, UPE_TX2_N, UPE_TX2_P, UPE_TX3_N, UPE_TX3_P, USB0_D_N, USB0_D_P, USB1_D_N, USB1_D_P, USB2_D_N, USB2_D_P, USB3_D_N, USB3_D_P, USB4_D_N, USB4_D_P, USB5_D_N, USB5_D_P, USB6_D_N, USB6_D_P, USB7_D_N, USB7_D_P, USB8_D_N, USB8_D_P, USB9_D_N, USB9_D_P, USB10_D_N, USB10_D_P, USB11_D_N, USB11_D_P, VCC1.05V, VCC1.8V, VCC3.3V, VCC5.0V, VCC12V, VSUS1.05V, VSUS3.3V

## Nets that join several sheets
GND: Connector (123 pins), Prom21Core (222 pins), pwr (119 pins), USB (36 pins)
VCC1.05V: Prom21Core (44 pins), pwr (8 pins)
VCC1.8V: Prom21Core (39 pins), pwr (8 pins)
VCC3.3V: Connector (12 pins), pwr (8 pins)
VCC5.0V: Connector (12 pins), pwr (16 pins), USB (15 pins)
VCC12V: Connector (16 pins), pwr (42 pins)
VSUS1.05V: Prom21Core (C26.2 C27.1 U5.U6), pwr (C121.2 C122.1 U12.5)
VSUS3.3V: Prom21Core (45 pins), pwr (5 pins)
PERSNT#: Connector (J1.A12 J5.A11 J6.A11 J7.A11), Prom21Core (U5.AC5)
SS0_RX_N: Prom21Core (U5.Y12), USB (U15.18)
SS0_RX_P: Prom21Core (U5.W12), USB (U15.17)
SS0_TX_N: Prom21Core (C53.1), USB (U15.21)
SS0_TX_P: Prom21Core (C52.1), USB (U15.20)
SS1_RX_N: Prom21Core (U5.W13), USB (U16.18)
SS1_RX_P: Prom21Core (U5.Y13), USB (U16.17)
SS1_TX_N: Prom21Core (C58.1), USB (U16.21)
SS1_TX_P: Prom21Core (C56.1), USB (U16.20)
SS2_RX_N: Prom21Core (U5.Y15), USB (U17.18)
SS2_RX_P: Prom21Core (U5.W15), USB (U17.17)
SS2_TX_N: Prom21Core (C63.1), USB (U17.21)
SS2_TX_P: Prom21Core (C61.1), USB (U17.20)
UPE_REFCLK_P: Connector (J1.B12 J1.B13), Prom21Core (U5.E23)
UPE_RX0_N: Connector (J1.B3 U2.1 U2.10), Prom21Core (U5.G5)
UPE_RX0_P: Connector (J1.B4 U2.2 U2.9), Prom21Core (U5.G4)
UPE_RX1_N: Connector (J1.B7 U2.5 U2.6), Prom21Core (U5.J5)
UPE_RX1_P: Connector (J1.B6 U2.4 U2.7), Prom21Core (U5.J4)
UPE_RX2_N: Connector (J1.B16 U4.2 U4.9), Prom21Core (U5.L5)
UPE_RX2_P: Connector (J1.B15 U4.1 U4.10), Prom21Core (U5.L4)
UPE_RX3_N: Connector (J1.B18 U4.4 U4.7), Prom21Core (U5.N5)
UPE_RX3_P: Connector (J1.B19 U4.5 U4.6), Prom21Core (U5.N4)
UPE_TX0_N: Connector (J1.A3 U1.2 U1.9), Prom21Core (C11.1)
UPE_TX0_P: Connector (J1.A4 U1.1 U1.10), Prom21Core (C10.1)
UPE_TX1_N: Connector (J1.A7 U1.5 U1.6), Prom21Core (C13.1)
UPE_TX1_P: Connector (J1.A6 U1.4 U1.7), Prom21Core (C12.1)
UPE_TX2_N: Connector (J1.A16 U3.2 U3.9), Prom21Core (C15.1)
UPE_TX2_P: Connector (J1.A15 U3.1 U3.10), Prom21Core (C14.1)
UPE_TX3_N: Connector (J1.A18 U3.5 U3.6), Prom21Core (C25.1)
UPE_TX3_P: Connector (J1.A19 U3.4 U3.7), Prom21Core (C16.1)
USB0_D_N: Connector (6 pins), Prom21Core (U5.U2)
USB0_D_P: Connector (6 pins), Prom21Core (U5.U1)
USB0_IN_CC1: Connector (J2.A5 J3.A5 J4.A5), USB (U15.1)
USB0_IN_CC2: Connector (J2.B5 J3.B5 J4.B5), USB (U15.28)
USB0_RX1_N: Connector (J2.B10 J3.B10 J4.B10), USB (U15.7 U19.2 U19.9)
USB0_RX1_P: Connector (J2.B11 J3.B11 J4.B11), USB (U15.6 U19.1 U19.10)
USB0_RX2_N: Connector (J2.A11 J3.A11 J4.A11), USB (U15.8 U19.4 U19.7)
USB0_RX2_P: Connector (J2.A10 J3.A10 J4.A10), USB (U15.9 U19.5 U19.6)
USB0_TX1_N: Connector (J2.A3 J3.A3 J4.A3), USB (U15.3 U18.4 U18.7)
USB0_TX1_P: Connector (J2.A2 J3.A2 J4.A2), USB (U15.2 U18.5 U18.6)
USB0_TX2_N: Connector (J2.B3 J3.B3 J4.B3), USB (U15.4 U18.2 U18.9)
USB0_TX2_P: Connector (J2.B2 J3.B2 J4.B2), USB (U15.5 U18.1 U18.10)
WAKE#: Connector (J1.B10 J5.B11 J6.B11 J7.B11), Prom21Core (U5.AC6)